# Altium project SOM Board with RK3399.PrjPcb (part 1 of 3)
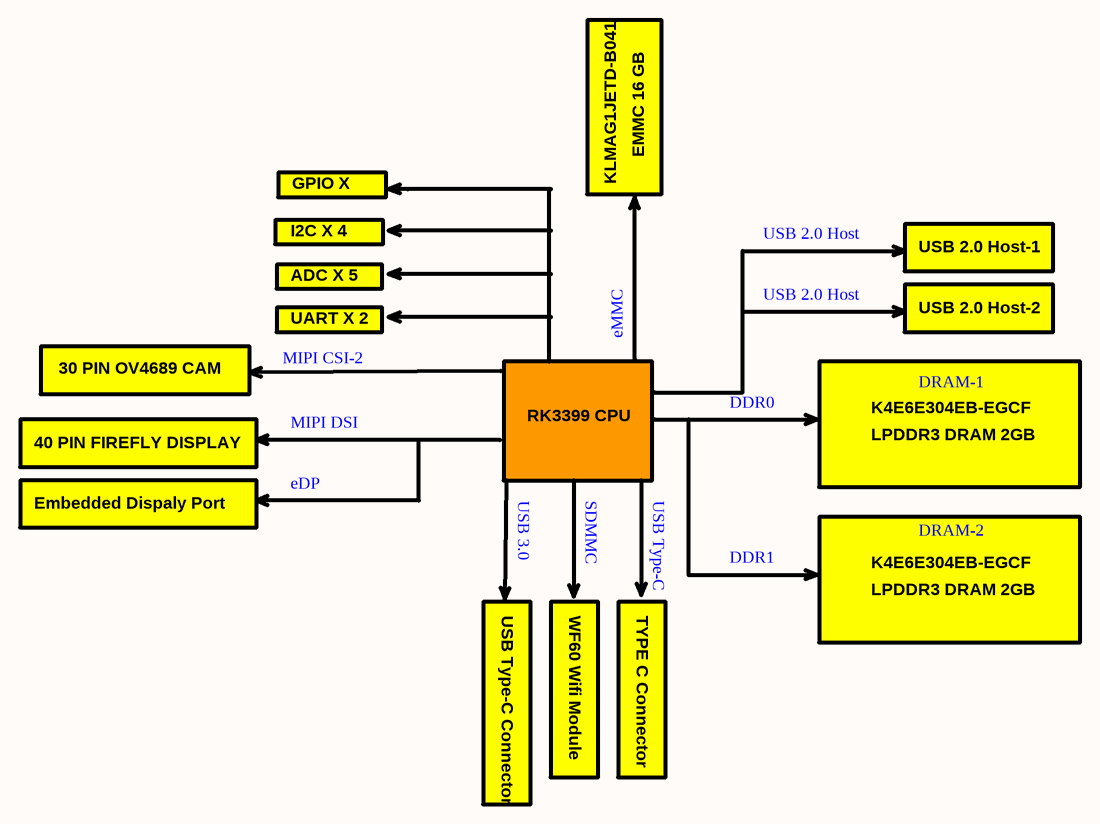
[diagram p0: [0]- Block Diagram.SchDoc]
12 sheets, 330 parts. Net scope: global (net labels, ports and power ports of the same name join across sheets).
Sheets:
  [0]- Block Diagram.SchDoc
  [1]-Power Pins Page of RK3399.SchDoc
  [2]-RK3399_EMMC_ADC_PCIE.SchDoc
  [3]-RK3399 EDP_CSI_HDMI.SchDoc
  [4]-USB2, TYPEC, USIC.SchDoc
  [5]-MIPI-CSI_GPIOs and I2C.SchDoc
  [6]-RGMII_SDIO_SPI_GPIOs etc.SchDoc
  [7]-RK3399 SDRAM Page.SchDoc
  [8]-LPDDR4 SDRAM-1.SchDoc
  [9]-LPDDR4 SDRAM-2.SchDoc
  [10]-EMMC Chip.SchDoc
  [11]-WIFI Module WF60.SchDoc

## Sheet [0]- Block Diagram.SchDoc: RK3399 SOM Board Design V1.0
size A4; Author: AVIRAL MISHRA; DocumentNumber: 1; SheetNumber: 1; SheetTotal: 12; PROJECT CODE: A_V1.0

### Notes on the sheet
- GPIO X
- KLMAG1JETD-B041
- EMMC 16 GB
- I2C X 4
- USB 2.0 Host
- USB 2.0 Host-1
- ADC X 5
- UART X 2
- eMMC
- USB 2.0 Host-2
- 30 PIN OV4689 CAM
- MIPI CSI-2
- DRAM-1
- 40 PIN FIREFLY DISPLAY
- MIPI DSI
- RK3399 CPU
- DDR0
- K4E6E304EB-EGCF
- LPDDR3 DRAM 2GB
- Embedded Dispaly Port
- eDP
- USB 3.0
- SDMMC
- USB Type-C
- DRAM-2
- DDR1
- USB Type-C Connector
- WF60 Wifi Module
- TYPE C Connector
- TITLE:
- DOCUMENT NAME:
- SCALE 1:1
- This document is copyright of EsteemPCB and shall not be revealed, produced, copied, in whole or in part, nor
- PROJECT CODE:
- TEMPLATE:
- A4
- AUTHOR:
- Sheet
- of
- used for any purpose other than submitted.

## Sheet [1]-Power Pins Page of RK3399.SchDoc: RK3399 SOM Board Design V1.0
size A3; Author: ABC; Organization: Altium Limited; Address1: L3, 12a Rodborough Rd; Address2: Frenchs Forest; Address3: NSW; Address4: Australia 2086; DocumentNumber: 2; SheetNumber: 2; SheetTotal: 12; PROJECT CODE: A_V1.0
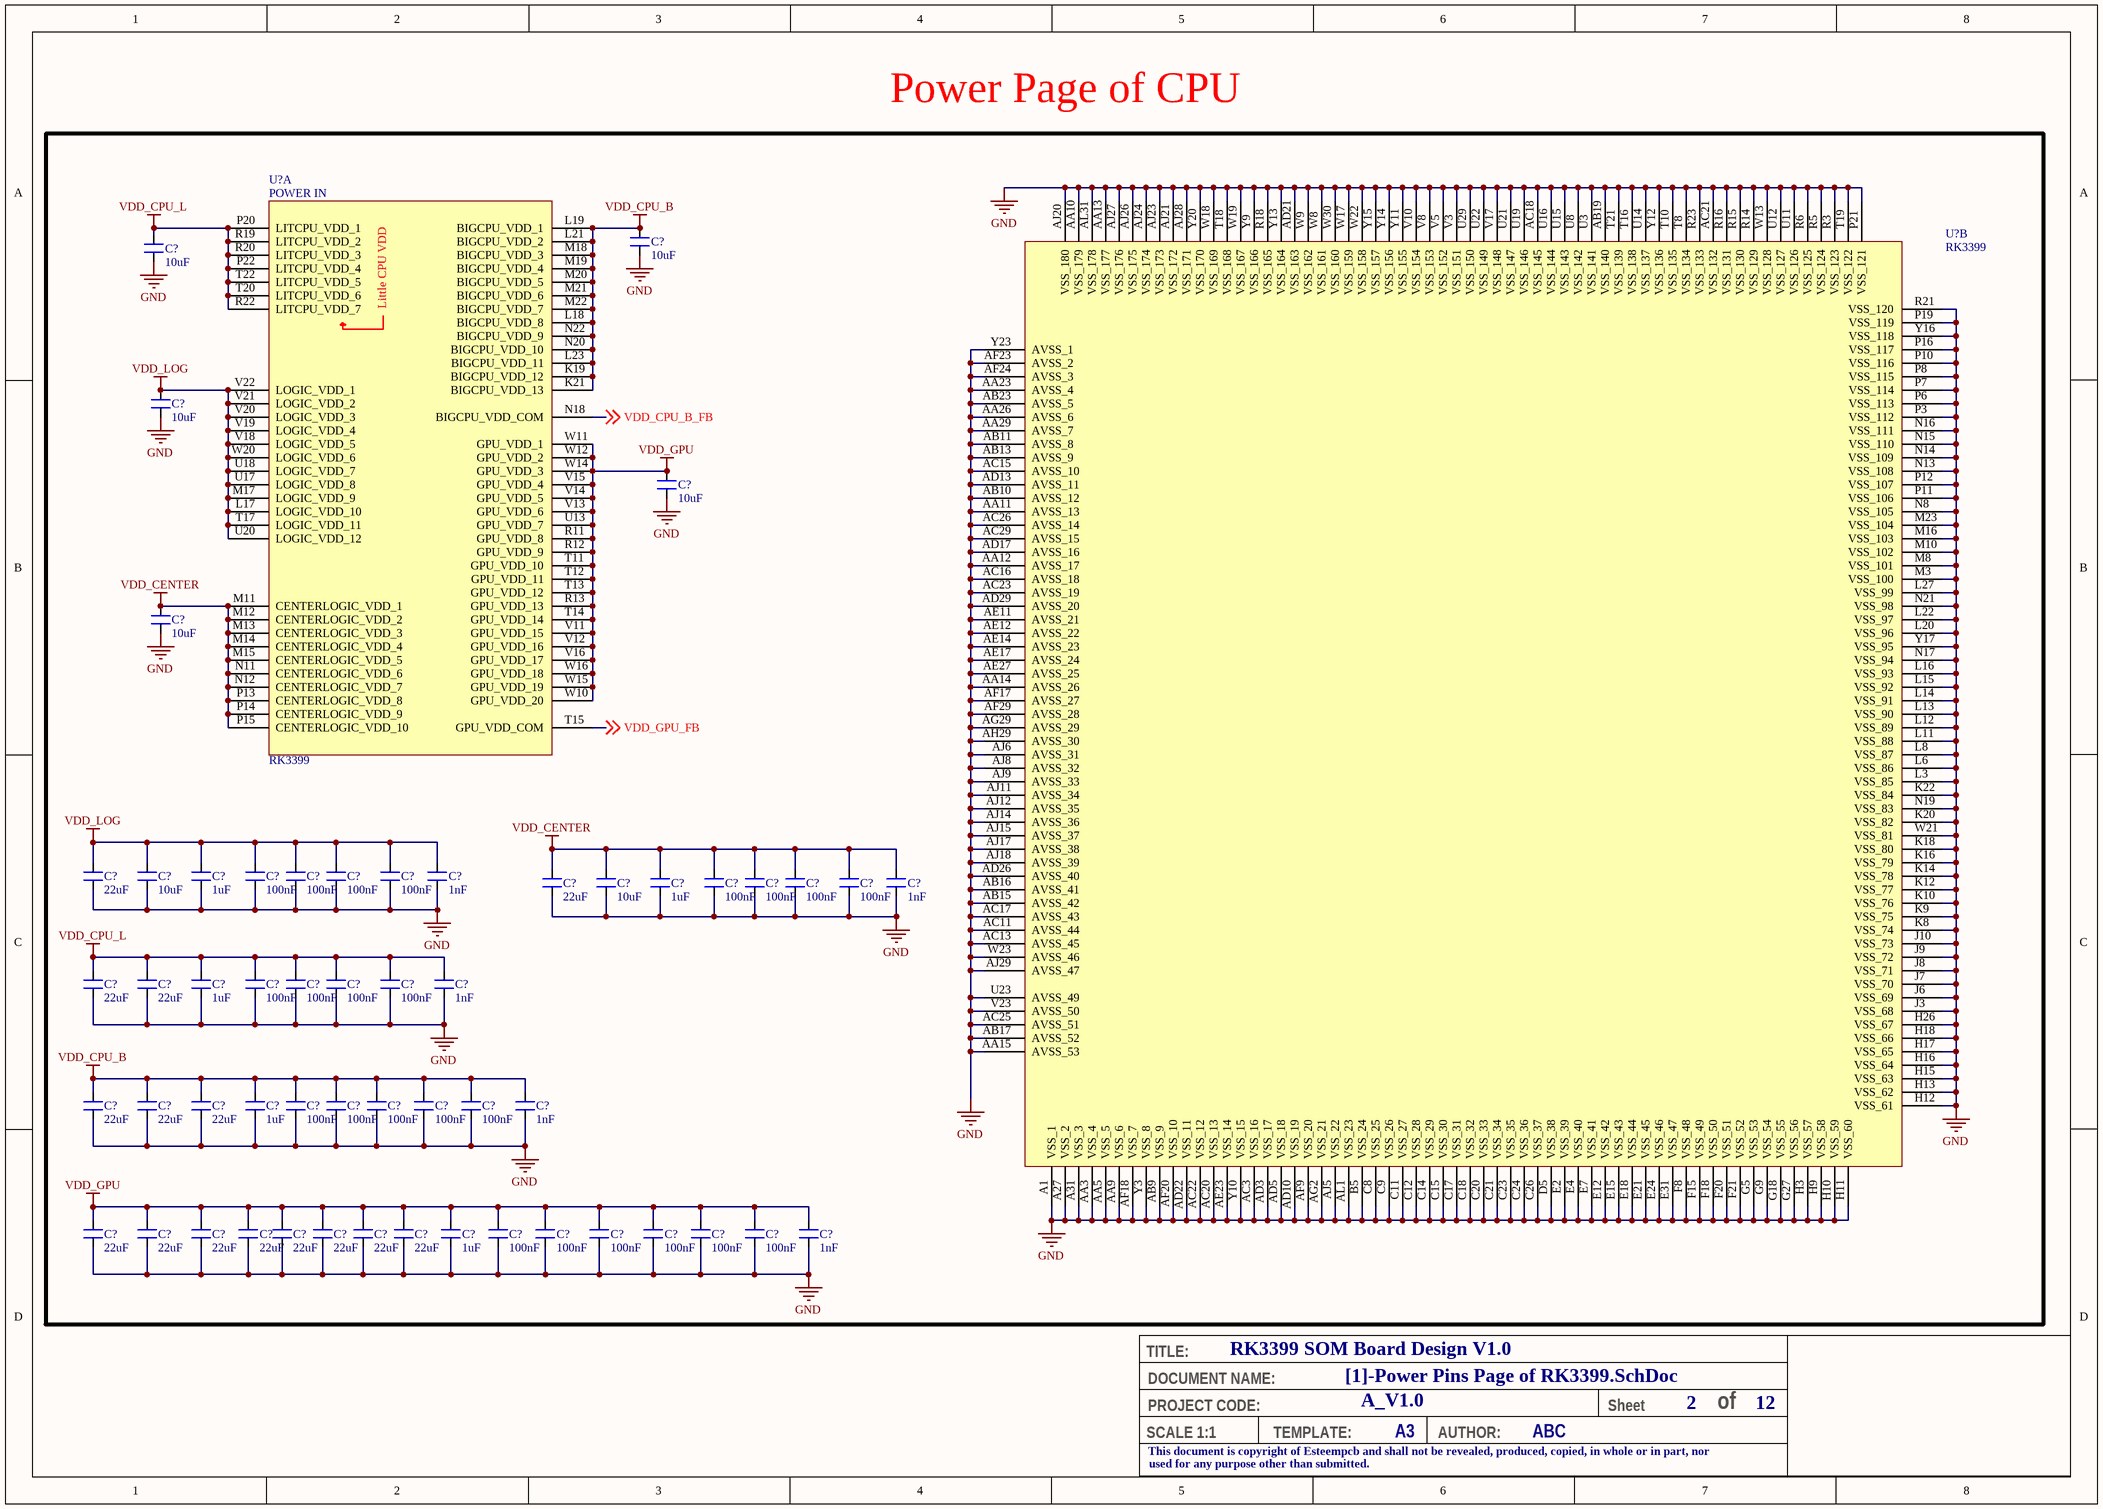
[diagram p1: [1]-Power Pins Page of RK3399.SchDoc]

### Parts
(Parts that share a designator on the sheet are numbered #1, #2 ... from top to bottom, then left to right.)
C?#1  10uF  [CAP_0402]
C?#2  10uF  [CAP_0402]
C?#3  10uF  [CAP_0402]
C?#4  10uF  [CAP_0402]
C?#5  10uF  [CAP_0402]
C?#6  22uF  [CAP_0402]
C?#7  10uF  [CAP_0402]
C?#8  1uF  [CAP_0201]
C?#9  100nF  [CAP_0201]
C?#10  100nF  [CAP_0201]
C?#11  100nF  [CAP_0201]
C?#12  100nF  [CAP_0201]
C?#13  1nF  [CAP_0201]
C?#14  22uF  [CAP_0402]
C?#15  10uF  [CAP_0402]
C?#16  1uF  [CAP_0201]
C?#17  100nF  [CAP_0201]
C?#18  100nF  [CAP_0201]
C?#19  100nF  [CAP_0201]
C?#20  100nF  [CAP_0201]
C?#21  1nF  [CAP_0201]
C?#22  22uF  [CAP_0402]
C?#23  22uF  [CAP_0402]
C?#24  1uF  [CAP_0201]
C?#25  100nF  [CAP_0201]
C?#26  100nF  [CAP_0201]
C?#27  100nF  [CAP_0201]
C?#28  100nF  [CAP_0201]
C?#29  1nF  [CAP_0201]
C?#30  22uF  [CAP_0402]
C?#31  22uF  [CAP_0402]
C?#32  22uF  [CAP_0402]
C?#33  1uF  [CAP_0201]
C?#34  100nF  [CAP_0201]
C?#35  100nF  [CAP_0201]
C?#36  100nF  [CAP_0201]
C?#37  100nF  [CAP_0201]
C?#38  100nF  [CAP_0201]
C?#39  1nF  [CAP_0201]
C?#40  22uF  [CAP_0402]
C?#41  22uF  [CAP_0402]
C?#42  22uF  [CAP_0402]
C?#43  22uF  [CAP_0402]
C?#44  22uF  [CAP_0402]
C?#45  22uF  [CAP_0402]
C?#46  22uF  [CAP_0402]
C?#47  22uF  [CAP_0402]
C?#48  1uF  [CAP_0201]
C?#49  100nF  [CAP_0201]
C?#50  100nF  [CAP_0201]
C?#51  100nF  [CAP_0201]
C?#52  100nF  [CAP_0201]
C?#53  100nF  [CAP_0201]
C?#54  100nF  [CAP_0201]
C?#55  1nF  [CAP_0201]
U?#1  RK3399  [FBGA828_23_826X826]  (part A of 24)
U?#2  RK3399  [FBGA828_23_826X826]  (part B of 24)

### Nets
GND: C?#1.1 C?#2.1 C?#3.1 C?#4.1 C?#5.1 C?#6.1 C?#7.1 C?#8.1 C?#9.1 C?#10.1 C?#11.1 C?#12.1 C?#13.1 C?#14.1 C?#15.1 C?#16.1 C?#17.1 C?#18.1 C?#19.1 C?#20.1 C?#21.1 C?#22.1 C?#23.1 C?#24.1 C?#25.1 C?#26.1 C?#27.1 C?#28.1 C?#29.1 C?#30.1 C?#31.1 C?#32.1 C?#33.1 C?#34.1 C?#35.1 C?#36.1 C?#37.1 C?#38.1 C?#39.1 C?#40.1 C?#41.1 C?#42.1 C?#43.1 C?#44.1 C?#45.1 C?#46.1 C?#47.1 C?#48.1 C?#49.1 C?#50.1 C?#51.1 C?#52.1 C?#53.1 C?#54.1 C?#55.1 U?#2.A1(VSS_1) U?#2.A27(VSS_2) U?#2.A31(VSS_3) U?#2.AA3(VSS_4) U?#2.AA5(VSS_5) U?#2.AA9(VSS_6) U?#2.AA10(VSS_179) U?#2.AA11(AVSS_13) U?#2.AA12(AVSS_17) U?#2.AA13(VSS_177) U?#2.AA14(AVSS_26) U?#2.AA15(AVSS_53) U?#2.AA23(AVSS_4) U?#2.AA26(AVSS_6) U?#2.AA29(AVSS_7) U?#2.AB9(VSS_9) U?#2.AB10(AVSS_12) U?#2.AB11(AVSS_8) U?#2.AB13(AVSS_9) U?#2.AB15(AVSS_42) U?#2.AB16(AVSS_41) U?#2.AB17(AVSS_52) U?#2.AB19(VSS_140) U?#2.AB23(AVSS_5) U?#2.AC3(VSS_16) U?#2.AC11(AVSS_44) U?#2.AC13(AVSS_45) U?#2.AC15(AVSS_10) U?#2.AC16(AVSS_18) U?#2.AC17(AVSS_43) U?#2.AC18(VSS_145) U?#2.AC20(VSS_13) U?#2.AC21(VSS_132) U?#2.AC22(VSS_12) U?#2.AC23(AVSS_19) U?#2.AC25(AVSS_51) U?#2.AC26(AVSS_14) U?#2.AC29(AVSS_15) U?#2.AD3(VSS_17) U?#2.AD5(VSS_18) U?#2.AD10(VSS_19) U?#2.AD13(AVSS_11) U?#2.AD17(AVSS_16) U?#2.AD21(VSS_163) U?#2.AD22(VSS_11) U?#2.AD26(AVSS_40) U?#2.AD29(AVSS_20) U?#2.AE11(AVSS_21) U?#2.AE12(AVSS_22) U?#2.AE14(AVSS_23) U?#2.AE17(AVSS_24) U?#2.AE23(VSS_14) U?#2.AE27(AVSS_25) U?#2.AF9(VSS_20) U?#2.AF17(AVSS_27) U?#2.AF18(VSS_7) U?#2.AF20(VSS_10) U?#2.AF23(AVSS_2) U?#2.AF24(AVSS_3) U?#2.AF29(AVSS_28) U?#2.AG2(VSS_21) U?#2.AG29(AVSS_29) U?#2.AH29(AVSS_30) U?#2.AJ5(VSS_22) U?#2.AJ6(AVSS_31) U?#2.AJ8(AVSS_32) U?#2.AJ9(AVSS_33) U?#2.AJ11(AVSS_34) U?#2.AJ12(AVSS_35) U?#2.AJ14(AVSS_36) U?#2.AJ15(AVSS_37) U?#2.AJ17(AVSS_38) U?#2.AJ18(AVSS_39) U?#2.AJ20(VSS_180) U?#2.AJ21(VSS_172) U?#2.AJ23(VSS_173) U?#2.AJ24(VSS_174) U?#2.AJ26(VSS_175) U?#2.AJ27(VSS_176) U?#2.AJ28(VSS_171) U?#2.AJ29(AVSS_47) U?#2.AL1(VSS_23) U?#2.AL31(VSS_178) U?#2.B5(VSS_24) U?#2.C8(VSS_25) U?#2.C9(VSS_26) U?#2.C11(VSS_27) U?#2.C12(VSS_28) U?#2.C14(VSS_29) U?#2.C15(VSS_30) U?#2.C17(VSS_31) U?#2.C18(VSS_32) U?#2.C20(VSS_33) U?#2.C21(VSS_34) U?#2.C23(VSS_35) U?#2.C24(VSS_36) U?#2.C26(VSS_37) U?#2.D5(VSS_38) U?#2.E2(VSS_39) U?#2.E4(VSS_40) U?#2.E7(VSS_41) U?#2.E12(VSS_42) U?#2.E15(VSS_43) U?#2.E18(VSS_44) U?#2.E21(VSS_45) U?#2.E24(VSS_46) U?#2.E31(VSS_47) U?#2.F8(VSS_48) U?#2.F15(VSS_49) U?#2.F18(VSS_50) U?#2.F20(VSS_51) U?#2.F21(VSS_52) U?#2.G5(VSS_53) U?#2.G9(VSS_54) U?#2.G18(VSS_55) U?#2.G27(VSS_56) U?#2.H3(VSS_57) U?#2.H9(VSS_58) U?#2.H10(VSS_59) U?#2.H11(VSS_60) U?#2.H12(VSS_61) U?#2.H13(VSS_62) U?#2.H15(VSS_63) U?#2.H16(VSS_64) U?#2.H17(VSS_65) U?#2.H18(VSS_66) U?#2.H26(VSS_67) U?#2.J3(VSS_68) U?#2.J6(VSS_69) U?#2.J7(VSS_70) U?#2.J8(VSS_71) U?#2.J9(VSS_72) U?#2.J10(VSS_73) U?#2.K8(VSS_74) U?#2.K9(VSS_75) U?#2.K10(VSS_76) U?#2.K12(VSS_77) U?#2.K14(VSS_78) U?#2.K16(VSS_79) U?#2.K18(VSS_80) U?#2.K20(VSS_82) U?#2.K22(VSS_84) U?#2.L3(VSS_85) U?#2.L6(VSS_86) U?#2.L8(VSS_87) U?#2.L11(VSS_88) U?#2.L12(VSS_89) U?#2.L13(VSS_90) U?#2.L14(VSS_91) U?#2.L15(VSS_92) U?#2.L16(VSS_93) U?#2.L20(VSS_96) U?#2.L22(VSS_97) U?#2.L27(VSS_99) U?#2.M3(VSS_100) U?#2.M8(VSS_101) U?#2.M10(VSS_102) U?#2.M16(VSS_103) U?#2.M23(VSS_104) U?#2.N8(VSS_105) U?#2.N13(VSS_108) U?#2.N14(VSS_109) U?#2.N15(VSS_110) U?#2.N16(VSS_111) U?#2.N17(VSS_94) U?#2.N19(VSS_83) U?#2.N21(VSS_98) U?#2.P3(VSS_112) U?#2.P6(VSS_113) U?#2.P7(VSS_114) U?#2.P8(VSS_115) U?#2.P10(VSS_116) U?#2.P11(VSS_106) U?#2.P12(VSS_107) U?#2.P16(VSS_117) U?#2.P19(VSS_119) U?#2.P21(VSS_121) U?#2.R3(VSS_123) U?#2.R5(VSS_124) U?#2.R6(VSS_125) U?#2.R14(VSS_129) U?#2.R15(VSS_130) U?#2.R16(VSS_131) U?#2.R18(VSS_165) U?#2.R21(VSS_120) U?#2.R23(VSS_133) U?#2.T8(VSS_134) U?#2.T10(VSS_135) U?#2.T16(VSS_138) U?#2.T18(VSS_168) U?#2.T19(VSS_122) U?#2.T21(VSS_139) U?#2.U3(VSS_141) U?#2.U8(VSS_142) U?#2.U11(VSS_126) U?#2.U12(VSS_127) U?#2.U14(VSS_137) U?#2.U15(VSS_143) U?#2.U16(VSS_144) U?#2.U19(VSS_146) U?#2.U21(VSS_147) U?#2.U22(VSS_149) U?#2.U23(AVSS_49) U?#2.U29(VSS_150) U?#2.V3(VSS_151) U?#2.V5(VSS_152) U?#2.V8(VSS_153) U?#2.V10(VSS_154) U?#2.V17(VSS_148) U?#2.V23(AVSS_50) U?#2.W8(VSS_161) U?#2.W9(VSS_162) U?#2.W13(VSS_128) U?#2.W17(VSS_159) U?#2.W18(VSS_169) U?#2.W19(VSS_167) U?#2.W21(VSS_81) U?#2.W22(VSS_158) U?#2.W23(AVSS_46) U?#2.W30(VSS_160) U?#2.Y3(VSS_8) U?#2.Y9(VSS_166) U?#2.Y10(VSS_15) U?#2.Y11(VSS_155) U?#2.Y12(VSS_136) U?#2.Y13(VSS_164) U?#2.Y14(VSS_156) U?#2.Y15(VSS_157) U?#2.Y16(VSS_118) U?#2.Y17(VSS_95) U?#2.Y20(VSS_170) U?#2.Y23(AVSS_1)
VDD_CENTER: C?#5.2 C?#14.2 C?#15.2 C?#16.2 C?#17.2 C?#18.2 C?#19.2 C?#20.2 C?#21.2 U?#1.M11(CENTERLOGIC_VDD_1) U?#1.M12(CENTERLOGIC_VDD_2) U?#1.M13(CENTERLOGIC_VDD_3) U?#1.M14(CENTERLOGIC_VDD_4) U?#1.M15(CENTERLOGIC_VDD_5) U?#1.N11(CENTERLOGIC_VDD_6) U?#1.N12(CENTERLOGIC_VDD_7) U?#1.P13(CENTERLOGIC_VDD_8) U?#1.P14(CENTERLOGIC_VDD_9) U?#1.P15(CENTERLOGIC_VDD_10)
VDD_CPU_B: C?#1.2 C?#30.2 C?#31.2 C?#32.2 C?#33.2 C?#34.2 C?#35.2 C?#36.2 C?#37.2 C?#38.2 C?#39.2 U?#1.K19(BIGCPU_VDD_12) U?#1.K21(BIGCPU_VDD_13) U?#1.L18(BIGCPU_VDD_8) U?#1.L19(BIGCPU_VDD_1) U?#1.L21(BIGCPU_VDD_2) U?#1.L23(BIGCPU_VDD_11) U?#1.M18(BIGCPU_VDD_3) U?#1.M19(BIGCPU_VDD_4) U?#1.M20(BIGCPU_VDD_5) U?#1.M21(BIGCPU_VDD_6) U?#1.M22(BIGCPU_VDD_7) U?#1.N20(BIGCPU_VDD_10) U?#1.N22(BIGCPU_VDD_9)
VDD_CPU_L: C?#2.2 C?#22.2 C?#23.2 C?#24.2 C?#25.2 C?#26.2 C?#27.2 C?#28.2 C?#29.2 U?#1.P20(LITCPU_VDD_1) U?#1.P22(LITCPU_VDD_4) U?#1.R19(LITCPU_VDD_2) U?#1.R20(LITCPU_VDD_3) U?#1.R22(LITCPU_VDD_7) U?#1.T20(LITCPU_VDD_6) U?#1.T22(LITCPU_VDD_5)
VDD_GPU: C?#4.2 C?#40.2 C?#41.2 C?#42.2 C?#43.2 C?#44.2 C?#45.2 C?#46.2 C?#47.2 C?#48.2 C?#49.2 C?#50.2 C?#51.2 C?#52.2 C?#53.2 C?#54.2 C?#55.2 U?#1.R11(GPU_VDD_8) U?#1.R12(GPU_VDD_9) U?#1.R13(GPU_VDD_13) U?#1.T11(GPU_VDD_10) U?#1.T12(GPU_VDD_11) U?#1.T13(GPU_VDD_12) U?#1.T14(GPU_VDD_14) U?#1.U13(GPU_VDD_7) U?#1.V11(GPU_VDD_15) U?#1.V12(GPU_VDD_16) U?#1.V13(GPU_VDD_6) U?#1.V14(GPU_VDD_5) U?#1.V15(GPU_VDD_4) U?#1.V16(GPU_VDD_17) U?#1.W10(GPU_VDD_20) U?#1.W11(GPU_VDD_1) U?#1.W12(GPU_VDD_2) U?#1.W14(GPU_VDD_3) U?#1.W15(GPU_VDD_19) U?#1.W16(GPU_VDD_18)
VDD_LOG: C?#3.2 C?#6.2 C?#7.2 C?#8.2 C?#9.2 C?#10.2 C?#11.2 C?#12.2 C?#13.2 U?#1.L17(LOGIC_VDD_10) U?#1.M17(LOGIC_VDD_9) U?#1.T17(LOGIC_VDD_11) U?#1.U17(LOGIC_VDD_8) U?#1.U18(LOGIC_VDD_7) U?#1.U20(LOGIC_VDD_12) U?#1.V18(LOGIC_VDD_5) U?#1.V19(LOGIC_VDD_4) U?#1.V20(LOGIC_VDD_3) U?#1.V21(LOGIC_VDD_2) U?#1.V22(LOGIC_VDD_1) U?#1.W20(LOGIC_VDD_6)
VDD_CPU_B_FB: U?#1.N18(BIGCPU_VDD_COM) ; off-sheet VDD_CPU_B_FB
VDD_GPU_FB: U?#1.T15(GPU_VDD_COM) ; off-sheet VDD_GPU_FB

### Notes on the sheet
- Power Page of CPU
- TITLE:
- DOCUMENT NAME:
- SCALE 1:1
- This document is copyright of Esteempcb and shall not be revealed, produced, copied, in whole or in part, nor
- PROJECT CODE:
- TEMPLATE:
- A3
- AUTHOR:
- Sheet
- of
- used for any purpose other than submitted.
- (in symbol IC_RK3399-FCBGA828, part A) POWER IN; Little CPU VDD

### Library data of the parts
C?#1-C?#5 C?#7 C?#15 = CAP_10uF-10V-20%-0402: 10µF ±20% 10V Ceramic Capacitor X5R 0402 (1005 Metric) /; Manufacturer Part Number: CL05A106MP5NUNC; Manufacturer: Samsung Electro-Mechanics; Case/Package: 0402; Supplier-1: Digikey
C?#6 C?#14 C?#22 C?#23 C?#30-C?#32 C?#40-C?#47 = CAP_22uF-6.3V-20%-0402: 22µF ±20% 6.3V Ceramic Capacitor X5R 0402 (1005 Metric) /; Manufacturer: Murata Electronics; Manufacturer Part Number: CL05A226MQ5N6J8; Case/Package: 0402; Supplier-1: Digikey
C?#8 C?#16 C?#24 C?#33 C?#48 = CAP_1uF-16V-10%-0201: 1µF ±20% 16V Ceramic Capacitor X5R 0201 (0603 Metric) /; Manufacturer: Samsung Electro-Mechanics; Manufacturer Part Number: CL03A105MO3NRNH; Case/Package: 0201; Supplier-1: Digikey
C?#9-C?#12 C?#17-C?#20 C?#25-C?#28 C?#34-C?#38 C?#49-C?#54 = CAP_100nF-25V-10%-0201: 0.1µF ±10% 25V Ceramic Capacitor X5R 0201 (0603 Metric) /; Manufacturer: TDK Corporation; Manufacturer Part Number: C0603X5R1E104K030BB; Case/Package: 0201; Supplier-1: Digikey
C?#13 C?#21 C?#29 C?#39 C?#55 = CAP_1nF-16V-10%-0201: 1000pF ±10% 16V Ceramic Capacitor X7R 0201 (0603 Metric) /; Manufacturer: Murata Electronics; Manufacturer Part Number: GRM033R71C102KA01D; Case/Package: 0201; Supplier-1: Digikey
U?#1 U?#2 = IC_RK3399-FCBGA828: RK3399 is a low power, high performance processor for computing, personal mobile.; Manufacturer: Rockchip; Manufacturer Part Number: RK3399; Case/Package: FCBGA828; Supplier-1: Rockchip

## Sheet [2]-RK3399_EMMC_ADC_PCIE.SchDoc: RK3399 SOM Board Design V1.0
size A4; Author: AVIRAL MISHRA; DocumentNumber: 3; SheetNumber: 3; SheetTotal: 12; PROJECT CODE: A_V1.0
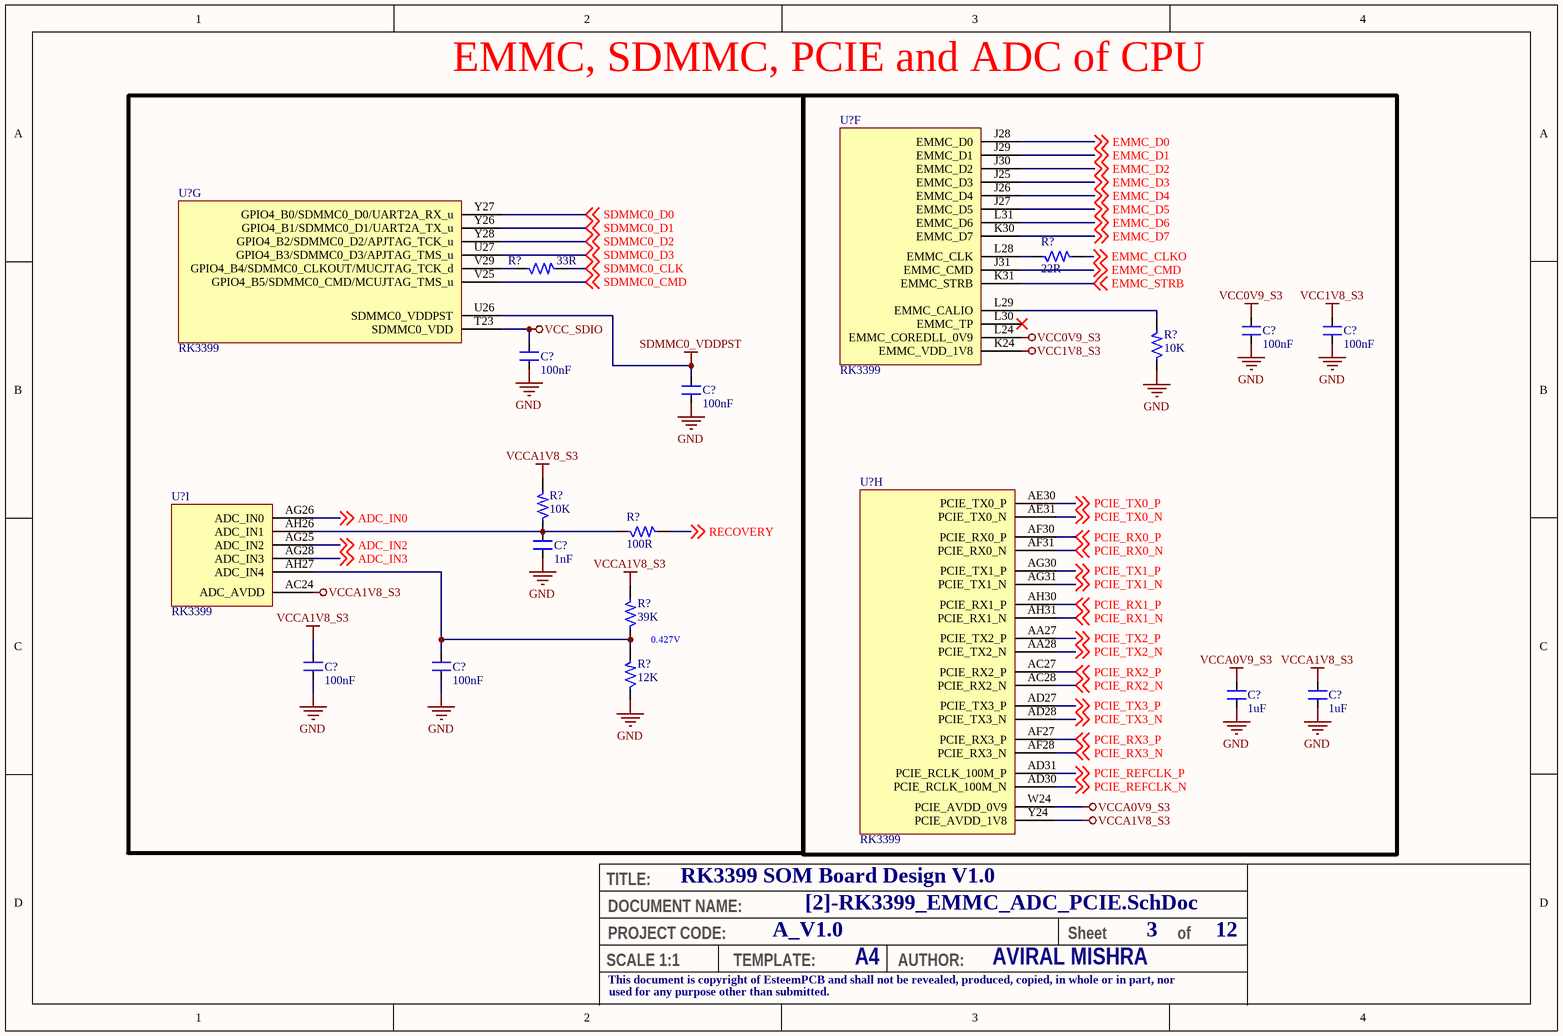
[diagram p2: [2]-RK3399_EMMC_ADC_PCIE.SchDoc]

### Parts
(Parts that share a designator on the sheet are numbered #1, #2 ... from top to bottom, then left to right.)
C?#56  100nF  [CAP_0201]
C?#57  100nF  [CAP_0201]
C?#58  100nF  [CAP_0201]
C?#59  100nF  [CAP_0201]
C?#60  1nF  [CAP_0201]
C?#61  100nF  [CAP_0201]
C?#62  100nF  [CAP_0201]
C?#63  1uF  [CAP_0201]
C?#64  1uF  [CAP_0201]
R?#1  22R  [RES_0201]
R?#2  33R  [RES_0201]
R?#3  10K  [RES_0201]
R?#4  10K  [RES_0201]
R?#5  100R  [RES_0201]
R?#6  39K  [RES_0201]
R?#7  12K  [RES_0201]
U?#3  RK3399  [FBGA828_23_826X826]  (part F of 24)
U?#4  RK3399  [FBGA828_23_826X826]  (part G of 24)
U?#5  RK3399  [FBGA828_23_826X826]  (part H of 24)
U?#6  RK3399  [FBGA828_23_826X826]  (part I of 24)

### Blocks framed on the sheet
EMMC, SDMMC, PCIE and ADC of CPU: C?#58-C?#62 R?#2 R?#4-R?#7 U?#4 U?#6

### Nets
GND: C?#56.1 C?#57.1 C?#58.1 C?#59.1 C?#60.1 C?#61.1 C?#62.1 C?#63.1 C?#64.1 R?#3.1 R?#7.1
SDMMC0_VDDPST: C?#59.2 U?#4.U26(SDMMC0_VDDPST)
VCC0V9_S3: C?#56.2 U?#3.L24(EMMC_COREDLL_0V9)
VCC1V8_S3: C?#57.2 U?#3.K24(EMMC_VDD_1V8)
VCC_SDIO: C?#58.2 U?#4.T23(SDMMC0_VDD)
VCCA0V9_S3: C?#63.2 U?#5.W24(PCIE_AVDD_0V9)
VCCA1V8_S3: C?#61.2 C?#64.2 R?#4.2 R?#6.2 U?#5.Y24(PCIE_AVDD_1V8) U?#6.AC24(ADC_AVDD)
ADC_IN0: U?#6.AG26(ADC_IN0) ; off-sheet ADC_IN0
ADC_IN2: U?#6.AG25(ADC_IN2) ; off-sheet ADC_IN2
ADC_IN3: U?#6.AG28(ADC_IN3) ; off-sheet ADC_IN3
EMMC_CLKO: R?#1.2 ; off-sheet EMMC_CLKO
EMMC_CMD: U?#3.J31(EMMC_CMD) ; off-sheet EMMC_CMD
EMMC_D0: U?#3.J28(EMMC_D0) ; off-sheet EMMC_D0
EMMC_D1: U?#3.J29(EMMC_D1) ; off-sheet EMMC_D1
EMMC_D2: U?#3.J30(EMMC_D2) ; off-sheet EMMC_D2
EMMC_D3: U?#3.J25(EMMC_D3) ; off-sheet EMMC_D3
EMMC_D4: U?#3.J26(EMMC_D4) ; off-sheet EMMC_D4
EMMC_D5: U?#3.J27(EMMC_D5) ; off-sheet EMMC_D5
EMMC_D6: U?#3.L31(EMMC_D6) ; off-sheet EMMC_D6
EMMC_D7: U?#3.K30(EMMC_D7) ; off-sheet EMMC_D7
EMMC_STRB: U?#3.K31(EMMC_STRB) ; off-sheet EMMC_STRB
PCIE_REFCLK_N: U?#5.AD30(PCIE_RCLK_100M_N) ; off-sheet PCIE_REFCLK_N
PCIE_REFCLK_P: U?#5.AD31(PCIE_RCLK_100M_P) ; off-sheet PCIE_REFCLK_P
PCIE_RX0_N: U?#5.AF31(PCIE_RX0_N) ; off-sheet PCIE_RX0_N
PCIE_RX0_P: U?#5.AF30(PCIE_RX0_P) ; off-sheet PCIE_RX0_P
PCIE_RX1_N: U?#5.AH31(PCIE_RX1_N) ; off-sheet PCIE_RX1_N
PCIE_RX1_P: U?#5.AH30(PCIE_RX1_P) ; off-sheet PCIE_RX1_P
PCIE_RX2_N: U?#5.AC28(PCIE_RX2_N) ; off-sheet PCIE_RX2_N
PCIE_RX2_P: U?#5.AC27(PCIE_RX2_P) ; off-sheet PCIE_RX2_P
PCIE_RX3_N: U?#5.AF28(PCIE_RX3_N) ; off-sheet PCIE_RX3_N
PCIE_RX3_P: U?#5.AF27(PCIE_RX3_P) ; off-sheet PCIE_RX3_P
PCIE_TX0_N: U?#5.AE31(PCIE_TX0_N) ; off-sheet PCIE_TX0_N
PCIE_TX0_P: U?#5.AE30(PCIE_TX0_P) ; off-sheet PCIE_TX0_P
PCIE_TX1_N: U?#5.AG31(PCIE_TX1_N) ; off-sheet PCIE_TX1_N
PCIE_TX1_P: U?#5.AG30(PCIE_TX1_P) ; off-sheet PCIE_TX1_P
PCIE_TX2_N: U?#5.AA28(PCIE_TX2_N) ; off-sheet PCIE_TX2_N
PCIE_TX2_P: U?#5.AA27(PCIE_TX2_P) ; off-sheet PCIE_TX2_P
PCIE_TX3_N: U?#5.AD28(PCIE_TX3_N) ; off-sheet PCIE_TX3_N
PCIE_TX3_P: U?#5.AD27(PCIE_TX3_P) ; off-sheet PCIE_TX3_P
RECOVERY: R?#5.2 ; off-sheet RECOVERY
SDMMC0_CLK: R?#2.2 ; off-sheet SDMMC0_CLK
SDMMC0_CMD: U?#4.V25(GPIO4_B5/SDMMC0_CMD/MCUJTAG_TMS_u) ; off-sheet SDMMC0_CMD
SDMMC0_D0: U?#4.Y27(GPIO4_B0/SDMMC0_D0/UART2A_RX_u) ; off-sheet SDMMC0_D0
SDMMC0_D1: U?#4.Y26(GPIO4_B1/SDMMC0_D1/UART2A_TX_u) ; off-sheet SDMMC0_D1
SDMMC0_D2: U?#4.Y28(GPIO4_B2/SDMMC0_D2/APJTAG_TCK_u) ; off-sheet SDMMC0_D2
SDMMC0_D3: U?#4.U27(GPIO4_B3/SDMMC0_D3/APJTAG_TMS_u) ; off-sheet SDMMC0_D3
NetC?#60_2: C?#60.2 R?#4.1 R?#5.1 U?#6.AH26(ADC_IN1)
NetC?#62_2: C?#62.2 R?#6.1 R?#7.2 U?#6.AH27(ADC_IN4)
NetR?#1_1: R?#1.1 U?#3.L28(EMMC_CLK)
NetR?#2_1: R?#2.1 U?#4.V29(GPIO4_B4/SDMMC0_CLKOUT/MUCJTAG_TCK_d)
NetR?#3_2: R?#3.2 U?#3.L29(EMMC_CALIO)

Not connected (* = marked no-connect by the designer): U?#3 L30(EMMC_TP)*

### Notes on the sheet
- (near R?#6) 0.427V
- TITLE:
- DOCUMENT NAME:
- SCALE 1:1
- This document is copyright of EsteemPCB and shall not be revealed, produced, copied, in whole or in part, nor
- PROJECT CODE:
- TEMPLATE:
- A4
- AUTHOR:
- Sheet
- of
- used for any purpose other than submitted.

### Library data of the parts
C?#56-C?#59 C?#61 C?#62 = CAP_100nF-25V-10%-0201: as C?#9 on sheet [1]-Power Pins Page of RK3399; Case/Package: 0201; Supplier-1: Digikey
C?#60 = CAP_1nF-16V-10%-0201: as C?#13 on sheet [1]-Power Pins Page of RK3399; Case/Package: 0201; Supplier-1: Digikey
C?#63 C?#64 = CAP_1uF-16V-10%-0201: as C?#8 on sheet [1]-Power Pins Page of RK3399; Case/Package: 0201; Supplier-1: Digikey
R?#1 = RES_22R-0.05W-1%-0201: 22 Ohms ±1% 0.05W, 1/20W Chip Resistor 0201 (0603 Metric) Moisture Resistant Thick Film /; Manufacturer: Yageo; Manufacturer Part Number: RC0201FR-0722RL; Case/Package: 0201; Supplier-1: Digikey
R?#2 = RES_33R-0.05W-1%-0201: 33 Ohms ±1% 0.05W, 1/20W Chip Resistor 0201 (0603 Metric) Thick Film /; Manufacturer: Yageo; Manufacturer Part Number: RC0201FR-0733RL; Case/Package: 0201; Supplier-1: Digikey
R?#3 R?#4 = RES_10K-0.05W-1%-0201: 10 kOhms ±1% 0.05W, 1/20W Chip Resistor 0201 (0603 Metric) Thick Film /; Manufacturer: Stackpole Electronics Inc; Manufacturer Part Number: RMCF0201FT10K0; Case/Package: 0201; Supplier-1: Digikey
R?#5 = RES_100R-0.05W-1%-0201: 100 kOhms ±1% 0.05W, 1/20W Chip Resistor 0201 (0603 Metric) Automotive AEC-Q200 Thick Film /; Manufacturer: Panasonic Electronic Components; Manufacturer Part Number: ERJ-1GNF1003C; Case/Package: 0201; Supplier-1: Digikey
R?#6 = RES_39K-0.05W-1%-0201: 39 kOhms ±1% 0.05W, 1/20W Chip Resistor 0201 (0603 Metric) Thick Film /; Manufacturer: Yageo; Manufacturer Part Number: RC0201FR-0739KL; Case/Package: 0201; Supplier-1: Digikey
R?#7 = RES_12K-0.05W-1%-0201: 12 kOhms ±1% 0.05W, 1/20W Chip Resistor 0201 (0603 Metric) Thick Film /; Manufacturer: Yageo; Manufacturer Part Number: RC0201FR-0712KL; Case/Package: 0201; Supplier-1: Digikey
U?#3-U?#6 = IC_RK3399-FCBGA828: as U?#1 on sheet [1]-Power Pins Page of RK3399; Manufacturer Part Number: RK3399; Case/Package: FCBGA828; Supplier-1: Rockchip

## Sheet [3]-RK3399 EDP_CSI_HDMI.SchDoc: RK3399 SOM Board Design V1.0
size A4; Author: AVIRAL MISHRA; DocumentNumber: 4; SheetNumber: 4; SheetTotal: 12; PROJECT CODE: A_V1.0
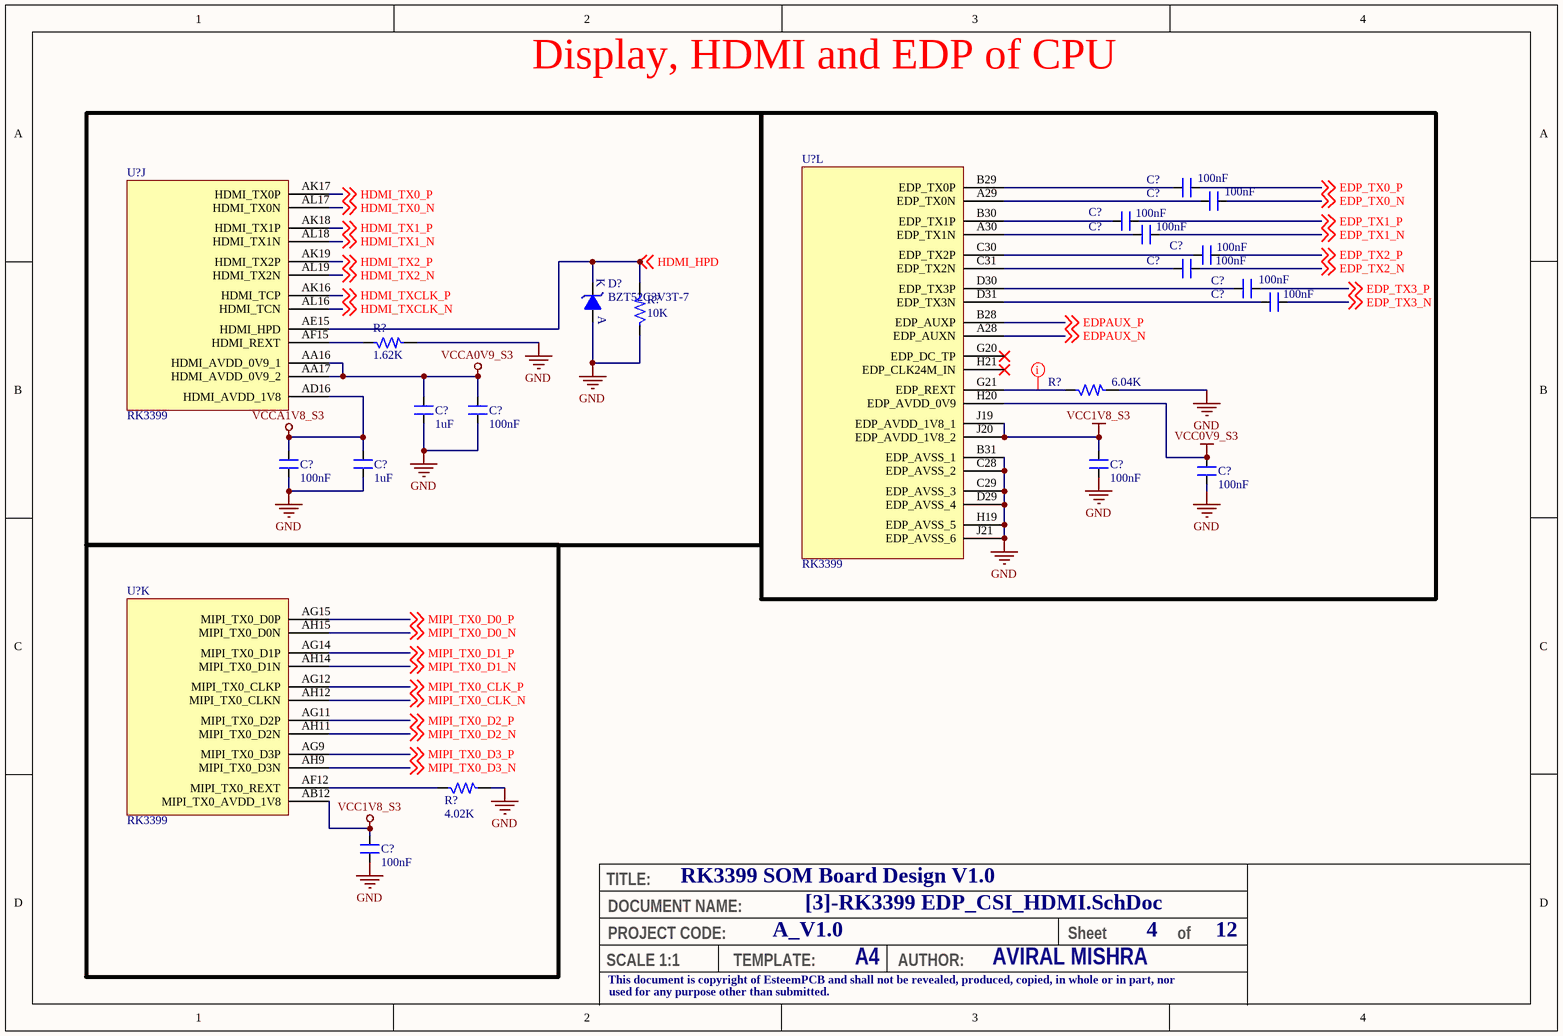
[diagram p3: [3]-RK3399 EDP_CSI_HDMI.SchDoc]

### Parts
(Parts that share a designator on the sheet are numbered #1, #2 ... from top to bottom, then left to right.)
C?#65  100nF  [CAP_0201]
C?#66  100nF  [CAP_0201]
C?#67  100nF  [CAP_0201]
C?#68  100nF  [CAP_0201]
C?#69  100nF  [CAP_0201]
C?#70  100nF  [CAP_0201]
C?#71  100nF  [CAP_0201]
C?#72  100nF  [CAP_0201]
C?#73  1uF  [CAP_0201]
C?#74  100nF  [CAP_0201]
C?#75  100nF  [CAP_0201]
C?#76  1uF  [CAP_0201]
C?#77  100nF  [CAP_0201]
C?#78  100nF  [CAP_0201]
C?#79  100nF  [CAP_0201]
D?#1  BZT52C3V3T-7  [DIO_SOD523]
R?#8  10K  [RES_0201]
R?#9  1.62K  [RES_0201]
R?#10  6.04K  [RES_0201]
R?#11  4.02K  [RES_0201]
U?#7  RK3399  [FBGA828_23_826X826]  (part L of 24)
U?#8  RK3399  [FBGA828_23_826X826]  (part J of 24)
U?#9  RK3399  [FBGA828_23_826X826]  (part K of 24)

### Nets
GND: C?#73.1 C?#74.1 C?#75.1 C?#76.1 C?#77.2 C?#78.1 C?#79.1 D?#1.A R?#8.1 R?#9.2 R?#10.2 R?#11.2 U?#7.B31(EDP_AVSS_1) U?#7.C28(EDP_AVSS_2) U?#7.C29(EDP_AVSS_3) U?#7.D29(EDP_AVSS_4) U?#7.H19(EDP_AVSS_5) U?#7.J21(EDP_AVSS_6)
VCC0V9_S3: C?#78.2 U?#7.H20(EDP_AVDD_0V9)
VCC1V8_S3: C?#77.1 C?#79.2 U?#7.J19(EDP_AVDD_1V8_1) U?#7.J20(EDP_AVDD_1V8_2) U?#9.AB12(MIPI_TX0_AVDD_1V8)
VCCA0V9_S3: C?#73.2 C?#74.2 U?#8.AA16(HDMI_AVDD_0V9_1) U?#8.AA17(HDMI_AVDD_0V9_2)
VCCA1V8_S3: C?#75.2 C?#76.2 U?#8.AD16(HDMI_AVDD_1V8)
EDP_TX0_N: C?#66.1 ; off-sheet EDP_TX0_N
EDP_TX0_P: C?#65.1 ; off-sheet EDP_TX0_P
EDP_TX1_N: C?#68.1 ; off-sheet EDP_TX1_N
EDP_TX1_P: C?#67.1 ; off-sheet EDP_TX1_P
EDP_TX2_N: C?#70.1 ; off-sheet EDP_TX2_N
EDP_TX2_P: C?#69.1 ; off-sheet EDP_TX2_P
EDP_TX3_N: C?#72.1 ; off-sheet EDP_TX3_N
EDP_TX3_P: C?#71.1 ; off-sheet EDP_TX3_P
EDPAUX_N: U?#7.A28(EDP_AUXN) ; off-sheet EDPAUX_N
EDPAUX_P: U?#7.B28(EDP_AUXP) ; off-sheet EDPAUX_P
HDMI_HPD: D?#1.K R?#8.2 U?#8.AE15(HDMI_HPD) ; off-sheet HDMI_HPD
HDMI_TX0_N: U?#8.AL17(HDMI_TX0N) ; off-sheet HDMI_TX0_N
HDMI_TX0_P: U?#8.AK17(HDMI_TX0P) ; off-sheet HDMI_TX0_P
HDMI_TX1_N: U?#8.AL18(HDMI_TX1N) ; off-sheet HDMI_TX1_N
HDMI_TX1_P: U?#8.AK18(HDMI_TX1P) ; off-sheet HDMI_TX1_P
HDMI_TX2_N: U?#8.AL19(HDMI_TX2N) ; off-sheet HDMI_TX2_N
HDMI_TX2_P: U?#8.AK19(HDMI_TX2P) ; off-sheet HDMI_TX2_P
HDMI_TXCLK_N: U?#8.AL16(HDMI_TCN) ; off-sheet HDMI_TXCLK_N
HDMI_TXCLK_P: U?#8.AK16(HDMI_TCP) ; off-sheet HDMI_TXCLK_P
MIPI_TX0_CLK_N: U?#9.AH12(MIPI_TX0_CLKN) ; off-sheet MIPI_TX0_CLK_N
MIPI_TX0_CLK_P: U?#9.AG12(MIPI_TX0_CLKP) ; off-sheet MIPI_TX0_CLK_P
MIPI_TX0_D0_N: U?#9.AH15(MIPI_TX0_D0N) ; off-sheet MIPI_TX0_D0_N
MIPI_TX0_D0_P: U?#9.AG15(MIPI_TX0_D0P) ; off-sheet MIPI_TX0_D0_P
MIPI_TX0_D1_N: U?#9.AH14(MIPI_TX0_D1N) ; off-sheet MIPI_TX0_D1_N
MIPI_TX0_D1_P: U?#9.AG14(MIPI_TX0_D1P) ; off-sheet MIPI_TX0_D1_P
MIPI_TX0_D2_N: U?#9.AH11(MIPI_TX0_D2N) ; off-sheet MIPI_TX0_D2_N
MIPI_TX0_D2_P: U?#9.AG11(MIPI_TX0_D2P) ; off-sheet MIPI_TX0_D2_P
MIPI_TX0_D3_N: U?#9.AH9(MIPI_TX0_D3N) ; off-sheet MIPI_TX0_D3_N
MIPI_TX0_D3_P: U?#9.AG9(MIPI_TX0_D3P) ; off-sheet MIPI_TX0_D3_P
NetC?#65_2: C?#65.2 U?#7.B29(EDP_TX0P)
NetC?#66_2: C?#66.2 U?#7.A29(EDP_TX0N)
NetC?#67_2: C?#67.2 U?#7.B30(EDP_TX1P)
NetC?#68_2: C?#68.2 U?#7.A30(EDP_TX1N)
NetC?#69_2: C?#69.2 U?#7.C30(EDP_TX2P)
NetC?#70_2: C?#70.2 U?#7.C31(EDP_TX2N)
NetC?#71_2: C?#71.2 U?#7.D30(EDP_TX3P)
NetC?#72_2: C?#72.2 U?#7.D31(EDP_TX3N)
NetR?#9_1: R?#9.1 U?#8.AF15(HDMI_REXT)
NetR?#10_1: R?#10.1 U?#7.G21(EDP_REXT)
NetR?#11_1: R?#11.1 U?#9.AF12(MIPI_TX0_REXT)

Not connected (* = marked no-connect by the designer): U?#7 G20(EDP_DC_TP)* H21(EDP_CLK24M_IN)*

### Layout directives
net class EDP_GROUP: NetR?#10_1

### Notes on the sheet
- Display, HDMI and EDP of CPU
- TITLE:
- DOCUMENT NAME:
- SCALE 1:1
- This document is copyright of EsteemPCB and shall not be revealed, produced, copied, in whole or in part, nor
- PROJECT CODE:
- TEMPLATE:
- A4
- AUTHOR:
- Sheet
- of
- used for any purpose other than submitted.

### Library data of the parts
C?#65-C?#72 C?#74 C?#75 C?#77-C?#79 = CAP_100nF-25V-10%-0201: as C?#9 on sheet [1]-Power Pins Page of RK3399; Case/Package: 0201; Supplier-1: Digikey
C?#73 C?#76 = CAP_1uF-16V-10%-0201: as C?#8 on sheet [1]-Power Pins Page of RK3399; Case/Package: 0201; Supplier-1: Digikey
D?#1 = DIO-Z_3.3V-300mW-SOD-523: Zener Diode 3.3V 300mW ±6% Surface Mount SOD-523 /; Manufacturer: Diodes Incorporated; Manufacturer Part Number: BZT52C3V3T-7; Case/Package: SOD523; Supplier-1: Digikey
R?#8 = RES_10K-0.05W-1%-0201: as R?#3 on sheet [2]-RK3399_EMMC_ADC_PCIE; Case/Package: 0201; Supplier-1: Digikey
R?#9 = RES_1.62K-0.05W-1%-0201: 1.62 kOhms ±1% 0.05W, 1/20W Chip Resistor 0201 (0603 Metric) Automotive AEC-Q200 Thick Film /; Manufacturer: Panasonic Electronic Components; Manufacturer Part Number: ERJ-1GNF1621C; Case/Package: 0201; Supplier-1: Digikey
R?#10 = RES_6.04K-0.05W-1%-0201: 6.04 kOhms ±1% 0.05W, 1/20W Chip Resistor 0201 (0603 Metric) Thick Film /; Manufacturer: Panasonic Electronic Components; Manufacturer Part Number: ERJ-1GEF6041C; Case/Package: 0201; Supplier-1: Digikey
R?#11 = RES_4.02K-0.05W-1%-0201: 4.02 kOhms ±1% 0.05W, 1/20W Chip Resistor 0201 (0603 Metric) Thick Film /; Manufacturer: Yageo; Manufacturer Part Number: RC0201FR-074K02L; Case/Package: 0201; Supplier-1: Digikey
U?#7-U?#9 = IC_RK3399-FCBGA828: as U?#1 on sheet [1]-Power Pins Page of RK3399; Manufacturer Part Number: RK3399; Case/Package: FCBGA828; Supplier-1: Rockchip

## Sheet [4]-USB2, TYPEC, USIC.SchDoc: RK3399 SOM Board Design V1.0
size A4; Author: AVIRAL MISHRA; DocumentNumber: 5; SheetNumber: 5; SheetTotal: 12; PROJECT CODE: A_V1.0
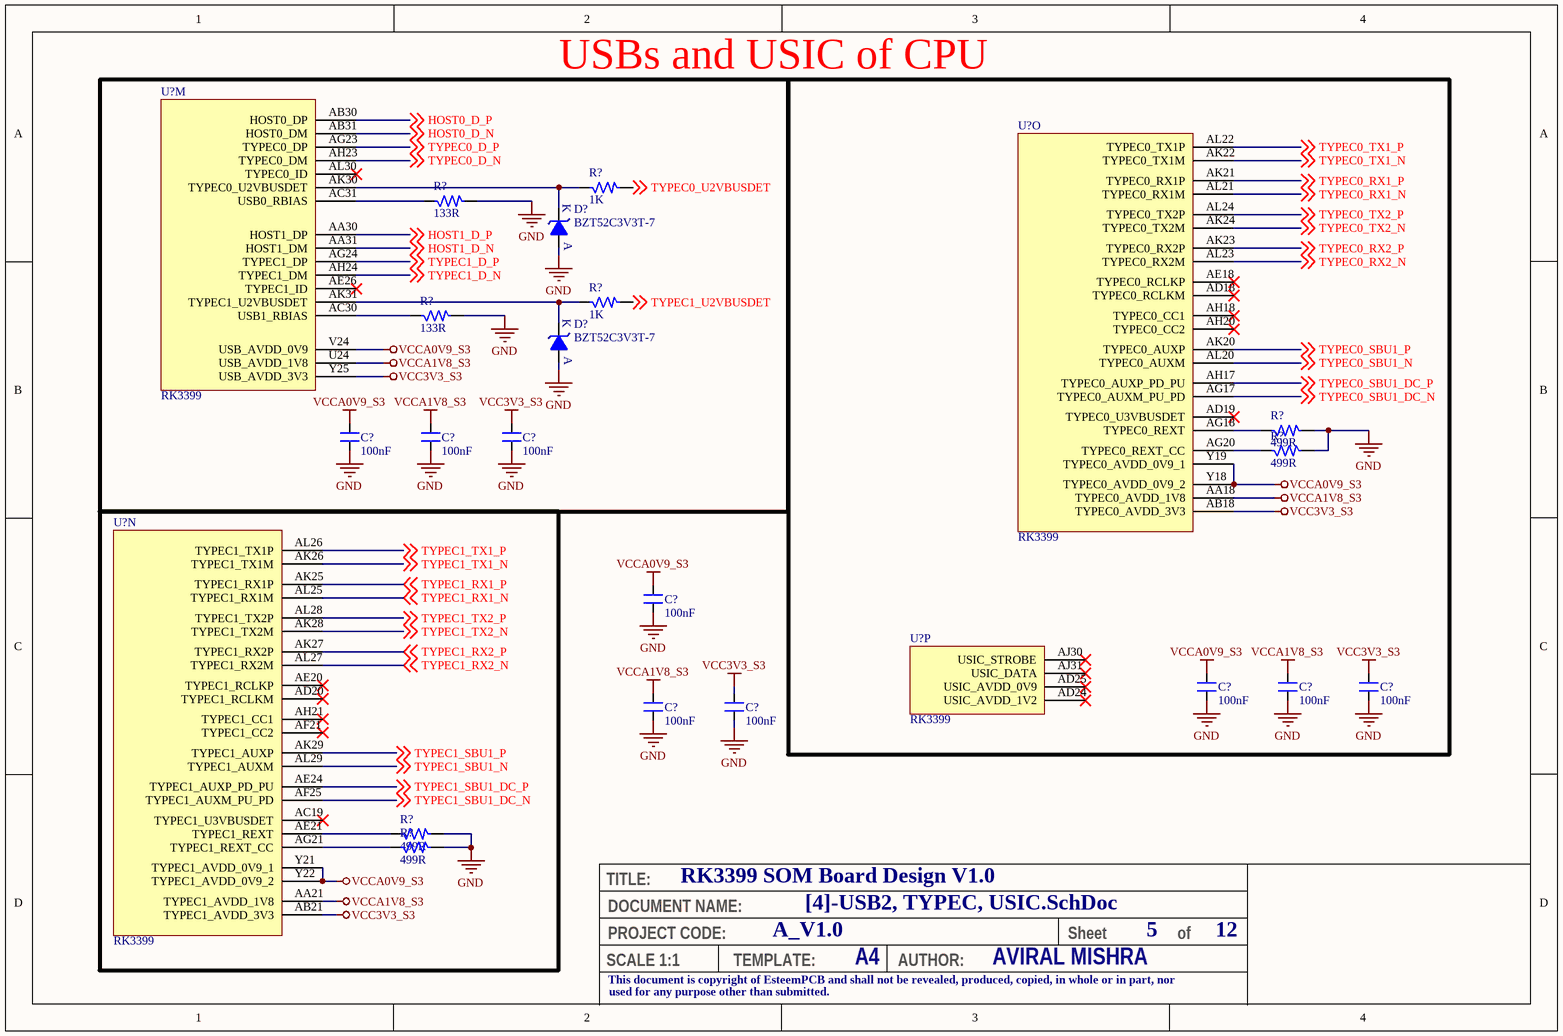
[diagram p4: [4]-USB2, TYPEC, USIC.SchDoc]

### Parts
(Parts that share a designator on the sheet are numbered #1, #2 ... from top to bottom, then left to right.)
C?#80  100nF  [CAP_0201]
C?#81  100nF  [CAP_0201]
C?#82  100nF  [CAP_0201]
C?#83  100nF  [CAP_0201]
C?#84  100nF  [CAP_0201]
C?#85  100nF  [CAP_0201]
C?#86  100nF  [CAP_0201]
C?#87  100nF  [CAP_0201]
C?#88  100nF  [CAP_0201]
D?#2  BZT52C3V3T-7  [DIO_SOD523]
D?#3  BZT52C3V3T-7  [DIO_SOD523]
R?#12  1K  [RES_0201]
R?#13  133R  [RES_0201]
R?#14  1K  [RES_0201]
R?#15  133R  [RES_0201]
R?#16  499R  [RES_0201]
R?#17  499R  [RES_0201]
R?#18  499R  [RES_0201]
R?#19  499R  [RES_0201]
U?#10  RK3399  [FBGA828_23_826X826]  (part M of 24)
U?#11  RK3399  [FBGA828_23_826X826]  (part O of 24)
U?#12  RK3399  [FBGA828_23_826X826]  (part N of 24)
U?#13  RK3399  [FBGA828_23_826X826]  (part P of 24)

### Blocks framed on the sheet
USBs and USIC of CPU: C?#80-C?#82 D?#2 D?#3 R?#12-R?#15 U?#10

### Nets
GND: C?#80.2 C?#81.1 C?#82.1 C?#83.1 C?#84.1 C?#85.1 C?#86.1 C?#87.1 C?#88.1 D?#2.A D?#3.A R?#13.2 R?#15.2 R?#16.2 R?#17.2 R?#18.2 R?#19.2
VCC3V3_S3: C?#82.2 C?#86.2 C?#88.2 U?#10.Y25(USB_AVDD_3V3) U?#11.AB18(TYPEC0_AVDD_3V3) U?#12.AB21(TYPEC1_AVDD_3V3)
VCCA0V9_S3: C?#80.1 C?#83.2 C?#84.2 U?#10.V24(USB_AVDD_0V9) U?#11.Y18(TYPEC0_AVDD_0V9_2) U?#11.Y19(TYPEC0_AVDD_0V9_1) U?#12.Y21(TYPEC1_AVDD_0V9_1) U?#12.Y22(TYPEC1_AVDD_0V9_2)
VCCA1V8_S3: C?#81.2 C?#85.2 C?#87.2 U?#10.U24(USB_AVDD_1V8) U?#11.AA18(TYPEC0_AVDD_1V8) U?#12.AA21(TYPEC1_AVDD_1V8)
HOST0_D_N: U?#10.AB31(HOST0_DM) ; off-sheet HOST0_D_N
HOST0_D_P: U?#10.AB30(HOST0_DP) ; off-sheet HOST0_D_P
HOST1_D_N: U?#10.AA31(HOST1_DM) ; off-sheet HOST1_D_N
HOST1_D_P: U?#10.AA30(HOST1_DP) ; off-sheet HOST1_D_P
TYPEC0_D_N: U?#10.AH23(TYPEC0_DM) ; off-sheet TYPEC0_D_N
TYPEC0_D_P: U?#10.AG23(TYPEC0_DP) ; off-sheet TYPEC0_D_P
TYPEC0_RX1_N: U?#11.AL21(TYPEC0_RX1M) ; off-sheet TYPEC0_RX1_N
TYPEC0_RX1_P: U?#11.AK21(TYPEC0_RX1P) ; off-sheet TYPEC0_RX1_P
TYPEC0_RX2_N: U?#11.AL23(TYPEC0_RX2M) ; off-sheet TYPEC0_RX2_N
TYPEC0_RX2_P: U?#11.AK23(TYPEC0_RX2P) ; off-sheet TYPEC0_RX2_P
TYPEC0_SBU1_DC_N: U?#11.AG17(TYPEC0_AUXM_PU_PD) ; off-sheet TYPEC0_SBU1_DC_N
TYPEC0_SBU1_DC_P: U?#11.AH17(TYPEC0_AUXP_PD_PU) ; off-sheet TYPEC0_SBU1_DC_P
TYPEC0_SBU1_N: U?#11.AL20(TYPEC0_AUXM) ; off-sheet TYPEC0_SBU1_N
TYPEC0_SBU1_P: U?#11.AK20(TYPEC0_AUXP) ; off-sheet TYPEC0_SBU1_P
TYPEC0_TX1_N: U?#11.AK22(TYPEC0_TX1M) ; off-sheet TYPEC0_TX1_N
TYPEC0_TX1_P: U?#11.AL22(TYPEC0_TX1P) ; off-sheet TYPEC0_TX1_P
TYPEC0_TX2_N: U?#11.AK24(TYPEC0_TX2M) ; off-sheet TYPEC0_TX2_N
TYPEC0_TX2_P: U?#11.AL24(TYPEC0_TX2P) ; off-sheet TYPEC0_TX2_P
TYPEC0_U2VBUSDET: R?#12.2 ; off-sheet TYPEC0_U2VBUSDET
TYPEC1_D_N: U?#10.AH24(TYPEC1_DM) ; off-sheet TYPEC1_D_N
TYPEC1_D_P: U?#10.AG24(TYPEC1_DP) ; off-sheet TYPEC1_D_P
TYPEC1_RX1_N: U?#12.AL25(TYPEC1_RX1M) ; off-sheet TYPEC1_RX1_N
TYPEC1_RX1_P: U?#12.AK25(TYPEC1_RX1P) ; off-sheet TYPEC1_RX1_P
TYPEC1_RX2_N: U?#12.AL27(TYPEC1_RX2M) ; off-sheet TYPEC1_RX2_N
TYPEC1_RX2_P: U?#12.AK27(TYPEC1_RX2P) ; off-sheet TYPEC1_RX2_P
TYPEC1_SBU1_DC_N: U?#12.AF25(TYPEC1_AUXM_PU_PD) ; off-sheet TYPEC1_SBU1_DC_N
TYPEC1_SBU1_DC_P: U?#12.AE24(TYPEC1_AUXP_PD_PU) ; off-sheet TYPEC1_SBU1_DC_P
TYPEC1_SBU1_N: U?#12.AL29(TYPEC1_AUXM) ; off-sheet TYPEC1_SBU1_N
TYPEC1_SBU1_P: U?#12.AK29(TYPEC1_AUXP) ; off-sheet TYPEC1_SBU1_P
TYPEC1_TX1_N: U?#12.AK26(TYPEC1_TX1M) ; off-sheet TYPEC1_TX1_N
TYPEC1_TX1_P: U?#12.AL26(TYPEC1_TX1P) ; off-sheet TYPEC1_TX1_P
TYPEC1_TX2_N: U?#12.AK28(TYPEC1_TX2M) ; off-sheet TYPEC1_TX2_N
TYPEC1_TX2_P: U?#12.AL28(TYPEC1_TX2P) ; off-sheet TYPEC1_TX2_P
TYPEC1_U2VBUSDET: R?#14.2 ; off-sheet TYPEC1_U2VBUSDET
NetD?#2_K: D?#2.K R?#12.1 U?#10.AK30(TYPEC0_U2VBUSDET)
NetD?#3_K: D?#3.K R?#14.1 U?#10.AK31(TYPEC1_U2VBUSDET)
NetR?#13_1: R?#13.1 U?#10.AC31(USB0_RBIAS)
NetR?#15_1: R?#15.1 U?#10.AC30(USB1_RBIAS)
NetR?#16_1: R?#16.1 U?#11.AG18(TYPEC0_REXT)
NetR?#17_1: R?#17.1 U?#11.AG20(TYPEC0_REXT_CC)
NetR?#18_1: R?#18.1 U?#12.AE21(TYPEC1_REXT)
NetR?#19_1: R?#19.1 U?#12.AG21(TYPEC1_REXT_CC)

Not connected (* = marked no-connect by the designer): U?#10 AE26(TYPEC1_ID)* AL30(TYPEC0_ID)*; U?#11 AD18(TYPEC0_RCLKM)* AD19(TYPEC0_U3VBUSDET)* AE18(TYPEC0_RCLKP)* AH18(TYPEC0_CC1)* AH20(TYPEC0_CC2)*; U?#12 AC19(TYPEC1_U3VBUSDET)* AD20(TYPEC1_RCLKM)* AE20(TYPEC1_RCLKP)* AF21(TYPEC1_CC2)* AH21(TYPEC1_CC1)*; U?#13 AD24(USIC_AVDD_1V2)* AD25(USIC_AVDD_0V9)* AJ30(USIC_STROBE)* AJ31(USIC_DATA)*

### Notes on the sheet
- TITLE:
- DOCUMENT NAME:
- SCALE 1:1
- This document is copyright of EsteemPCB and shall not be revealed, produced, copied, in whole or in part, nor
- PROJECT CODE:
- TEMPLATE:
- A4
- AUTHOR:
- Sheet
- of
- used for any purpose other than submitted.

### Library data of the parts
C?#80-C?#88 = CAP_100nF-25V-10%-0201: as C?#9 on sheet [1]-Power Pins Page of RK3399; Case/Package: 0201; Supplier-1: Digikey
D?#2 D?#3 = DIO-Z_3.3V-300mW-SOD-523: as D?#1 on sheet [3]-RK3399 EDP_CSI_HDMI; Manufacturer Part Number: BZT52C3V3T-7; Case/Package: SOD523; Supplier-1: Digikey
R?#12 R?#14 = RES_1K-0.05W-1%-0201: 1 kOhms ±1% 0.05W, 1/20W Chip Resistor 0201 (0603 Metric) Thick Film /; Manufacturer: Yageo; Manufacturer Part Number: RC0201FR-071KL; Case/Package: 0201; Supplier-1: Digikey
R?#13 R?#15 = RES_133R-0.05W-1%-0201: 133 Ohms ±1% 0.05W, 1/20W Chip Resistor 0201 (0603 Metric) Automotive AEC-Q200 Thick Film /; Manufacturer: Panasonic Electronic Components; Manufacturer Part Number: ERJ-1GNF1330C; Case/Package: 0201; Supplier-1: Digikey
R?#16-R?#19 = RES_499R-0.05W-1%-0201: 499 Ohms ±1% 0.05W, 1/20W Chip Resistor 0201 (0603 Metric) Thick Film /; Manufacturer: Stackpole Electronics Inc; Manufacturer Part Number: RMCF0201FT499R; Case/Package: 0201; Supplier-1: Digikey
U?#10-U?#13 = IC_RK3399-FCBGA828: as U?#1 on sheet [1]-Power Pins Page of RK3399; Manufacturer Part Number: RK3399; Case/Package: FCBGA828; Supplier-1: Rockchip

## Sheet [5]-MIPI-CSI_GPIOs and I2C.SchDoc: RK3399 SOM Board Design V1.0
size A4; Author: AVIRAL MISHRA; DocumentNumber: 6; SheetNumber: 6; SheetTotal: 12; PROJECT CODE: A_V1.0
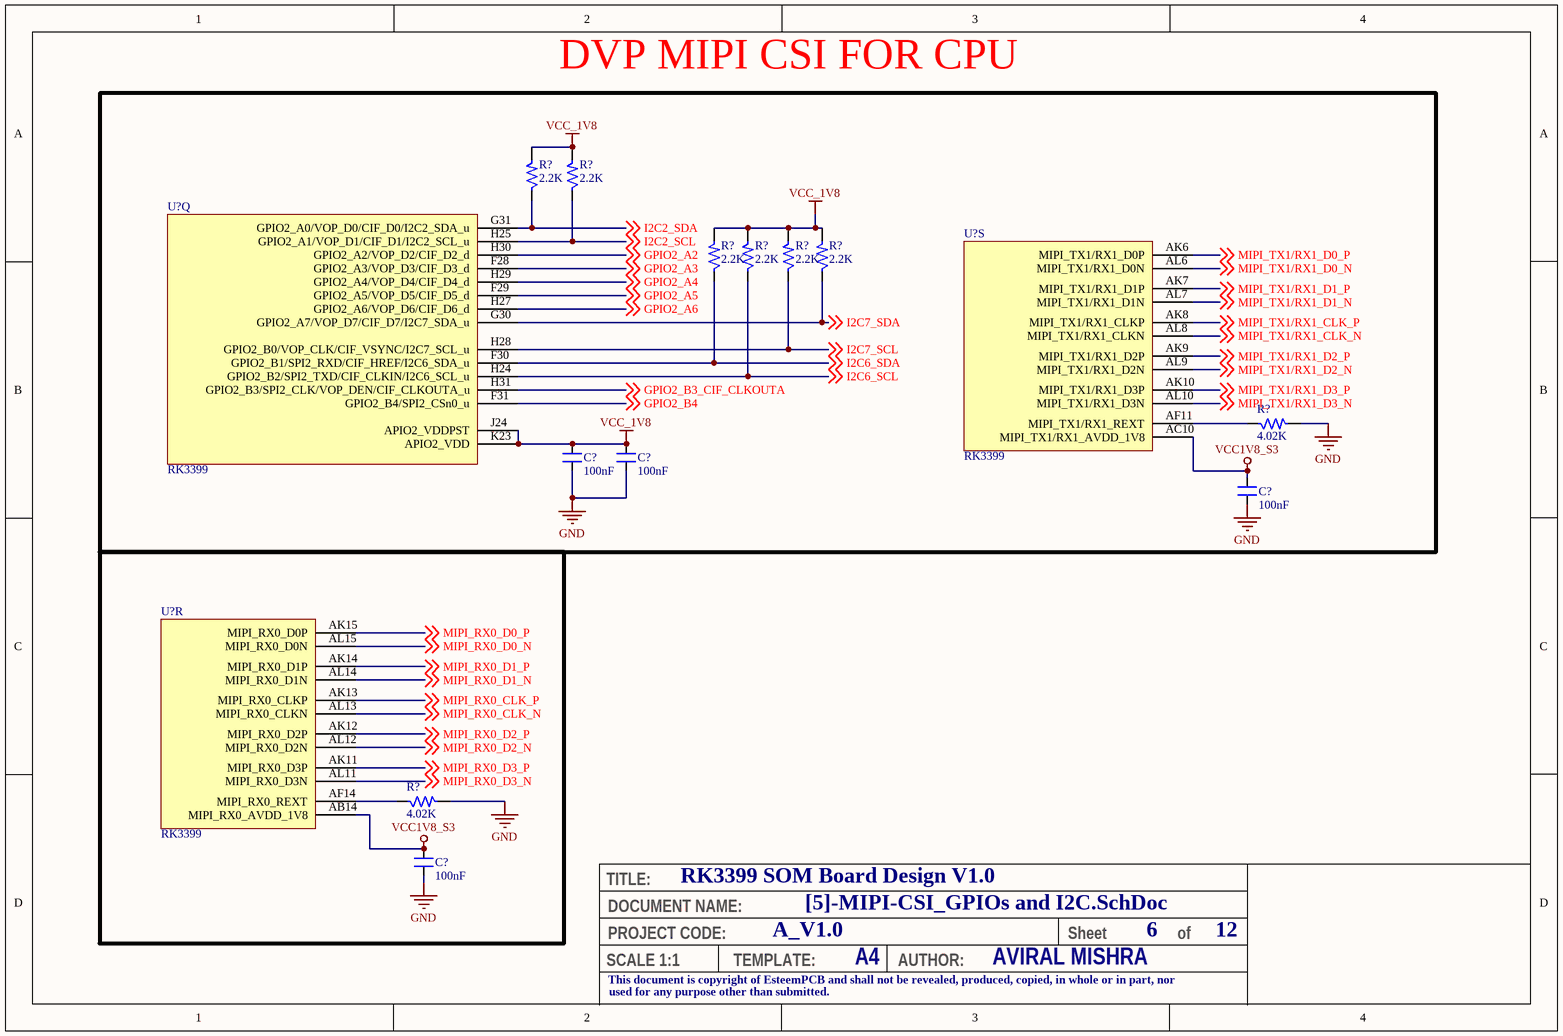
[diagram p5: [5]-MIPI-CSI_GPIOs and I2C.SchDoc]

### Parts
(Parts that share a designator on the sheet are numbered #1, #2 ... from top to bottom, then left to right.)
C?#89  100nF  [CAP_0201]
C?#90  100nF  [CAP_0201]
C?#91  100nF  [CAP_0201]
C?#92  100nF  [CAP_0201]
R?#20  2.2K  [RES_0201]
R?#21  2.2K  [RES_0201]
R?#22  2.2K  [RES_0201]
R?#23  2.2K  [RES_0201]
R?#24  2.2K  [RES_0201]
R?#25  2.2K  [RES_0201]
R?#26  4.02K  [RES_0201]
R?#27  4.02K  [RES_0201]
U?#14  RK3399  [FBGA828_23_826X826]  (part Q of 24)
U?#15  RK3399  [FBGA828_23_826X826]  (part S of 24)
U?#16  RK3399  [FBGA828_23_826X826]  (part R of 24)

### Blocks framed on the sheet
DVP MIPI CSI FOR CPU: C?#89-C?#91 R?#20-R?#26 U?#14 U?#15

### Nets
GND: C?#89.1 C?#90.1 C?#91.1 C?#92.1 R?#26.2 R?#27.2
VCC1V8_S3: C?#91.2 C?#92.2 U?#15.AC10(MIPI_TX1/RX1_AVDD_1V8) U?#16.AB14(MIPI_RX0_AVDD_1V8)
VCC_1V8: C?#89.2 C?#90.2 R?#20.2 R?#21.2 R?#22.2 R?#23.2 R?#24.2 R?#25.2 U?#14.J24(APIO2_VDDPST) U?#14.K23(APIO2_VDD)
GPIO2_A2: U?#14.H30(GPIO2_A2/VOP_D2/CIF_D2_d) ; off-sheet GPIO2_A2
GPIO2_A3: U?#14.F28(GPIO2_A3/VOP_D3/CIF_D3_d) ; off-sheet GPIO2_A3
GPIO2_A4: U?#14.H29(GPIO2_A4/VOP_D4/CIF_D4_d) ; off-sheet GPIO2_A4
GPIO2_A5: U?#14.F29(GPIO2_A5/VOP_D5/CIF_D5_d) ; off-sheet GPIO2_A5
GPIO2_A6: U?#14.H27(GPIO2_A6/VOP_D6/CIF_D6_d) ; off-sheet GPIO2_A6
GPIO2_B3_CIF_CLKOUTA: U?#14.H31(GPIO2_B3/SPI2_CLK/VOP_DEN/CIF_CLKOUTA_u) ; off-sheet GPIO2_B3_CIF_CLKOUTA
GPIO2_B4: U?#14.F31(GPIO2_B4/SPI2_CSn0_u) ; off-sheet GPIO2_B4
I2C2_SCL: R?#21.1 U?#14.H25(GPIO2_A1/VOP_D1/CIF_D1/I2C2_SCL_u) ; off-sheet I2C2_SCL
I2C2_SDA: R?#20.1 U?#14.G31(GPIO2_A0/VOP_D0/CIF_D0/I2C2_SDA_u) ; off-sheet I2C2_SDA
I2C6_SCL: R?#23.1 U?#14.H24(GPIO2_B2/SPI2_TXD/CIF_CLKIN/I2C6_SCL_u) ; off-sheet I2C6_SCL
I2C6_SDA: R?#22.1 U?#14.F30(GPIO2_B1/SPI2_RXD/CIF_HREF/I2C6_SDA_u) ; off-sheet I2C6_SDA
I2C7_SCL: R?#24.1 U?#14.H28(GPIO2_B0/VOP_CLK/CIF_VSYNC/I2C7_SCL_u) ; off-sheet I2C7_SCL
I2C7_SDA: R?#25.1 U?#14.G30(GPIO2_A7/VOP_D7/CIF_D7/I2C7_SDA_u) ; off-sheet I2C7_SDA
MIPI_RX0_CLK_N: U?#16.AL13(MIPI_RX0_CLKN) ; off-sheet MIPI_RX0_CLK_N
MIPI_RX0_CLK_P: U?#16.AK13(MIPI_RX0_CLKP) ; off-sheet MIPI_RX0_CLK_P
MIPI_RX0_D0_N: U?#16.AL15(MIPI_RX0_D0N) ; off-sheet MIPI_RX0_D0_N
MIPI_RX0_D0_P: U?#16.AK15(MIPI_RX0_D0P) ; off-sheet MIPI_RX0_D0_P
MIPI_RX0_D1_N: U?#16.AL14(MIPI_RX0_D1N) ; off-sheet MIPI_RX0_D1_N
MIPI_RX0_D1_P: U?#16.AK14(MIPI_RX0_D1P) ; off-sheet MIPI_RX0_D1_P
MIPI_RX0_D2_N: U?#16.AL12(MIPI_RX0_D2N) ; off-sheet MIPI_RX0_D2_N
MIPI_RX0_D2_P: U?#16.AK12(MIPI_RX0_D2P) ; off-sheet MIPI_RX0_D2_P
MIPI_RX0_D3_N: U?#16.AL11(MIPI_RX0_D3N) ; off-sheet MIPI_RX0_D3_N
MIPI_RX0_D3_P: U?#16.AK11(MIPI_RX0_D3P) ; off-sheet MIPI_RX0_D3_P
MIPI_TX1/RX1_CLK_N: U?#15.AL8(MIPI_TX1/RX1_CLKN) ; off-sheet MIPI_TX1/RX1_CLK_N
MIPI_TX1/RX1_CLK_P: U?#15.AK8(MIPI_TX1/RX1_CLKP) ; off-sheet MIPI_TX1/RX1_CLK_P
MIPI_TX1/RX1_D0_N: U?#15.AL6(MIPI_TX1/RX1_D0N) ; off-sheet MIPI_TX1/RX1_D0_N
MIPI_TX1/RX1_D0_P: U?#15.AK6(MIPI_TX1/RX1_D0P) ; off-sheet MIPI_TX1/RX1_D0_P
MIPI_TX1/RX1_D1_N: U?#15.AL7(MIPI_TX1/RX1_D1N) ; off-sheet MIPI_TX1/RX1_D1_N
MIPI_TX1/RX1_D1_P: U?#15.AK7(MIPI_TX1/RX1_D1P) ; off-sheet MIPI_TX1/RX1_D1_P
MIPI_TX1/RX1_D2_N: U?#15.AL9(MIPI_TX1/RX1_D2N) ; off-sheet MIPI_TX1/RX1_D2_N
MIPI_TX1/RX1_D2_P: U?#15.AK9(MIPI_TX1/RX1_D2P) ; off-sheet MIPI_TX1/RX1_D2_P
MIPI_TX1/RX1_D3_N: U?#15.AL10(MIPI_TX1/RX1_D3N) ; off-sheet MIPI_TX1/RX1_D3_N
MIPI_TX1/RX1_D3_P: U?#15.AK10(MIPI_TX1/RX1_D3P) ; off-sheet MIPI_TX1/RX1_D3_P
NetR?#26_1: R?#26.1 U?#15.AF11(MIPI_TX1/RX1_REXT)
NetR?#27_1: R?#27.1 U?#16.AF14(MIPI_RX0_REXT)

### Notes on the sheet
- TITLE:
- DOCUMENT NAME:
- SCALE 1:1
- This document is copyright of EsteemPCB and shall not be revealed, produced, copied, in whole or in part, nor
- PROJECT CODE:
- TEMPLATE:
- A4
- AUTHOR:
- Sheet
- of
- used for any purpose other than submitted.

### Library data of the parts
C?#89-C?#92 = CAP_100nF-25V-10%-0201: as C?#9 on sheet [1]-Power Pins Page of RK3399; Case/Package: 0201; Supplier-1: Digikey
R?#20-R?#25 = RES_2.2K-0.05W-1%-0201: 2.2 kOhms ±1% 0.05W, 1/20W Chip Resistor 0201 (0603 Metric) Thick Film /; Manufacturer: Stackpole Electronics Inc; Manufacturer Part Number: RMCF0201FT2K20; Case/Package: 0201; Supplier-1: Digikey
R?#26 R?#27 = RES_4.02K-0.05W-1%-0201: as R?#11 on sheet [3]-RK3399 EDP_CSI_HDMI; Case/Package: 0201; Supplier-1: Digikey
U?#14-U?#16 = IC_RK3399-FCBGA828: as U?#1 on sheet [1]-Power Pins Page of RK3399; Manufacturer Part Number: RK3399; Case/Package: FCBGA828; Supplier-1: Rockchip

## Sheet [6]-RGMII_SDIO_SPI_GPIOs etc.SchDoc: RK3399 SOM Board Design V1.0
size A3; Author: ABC; Organization: Altium Limited; Address1: L3, 12a Rodborough Rd; Address2: Frenchs Forest; Address3: NSW; Address4: Australia 2086; DocumentNumber: 7; SheetNumber: 7; SheetTotal: 12; PROJECT CODE: A_V1.0
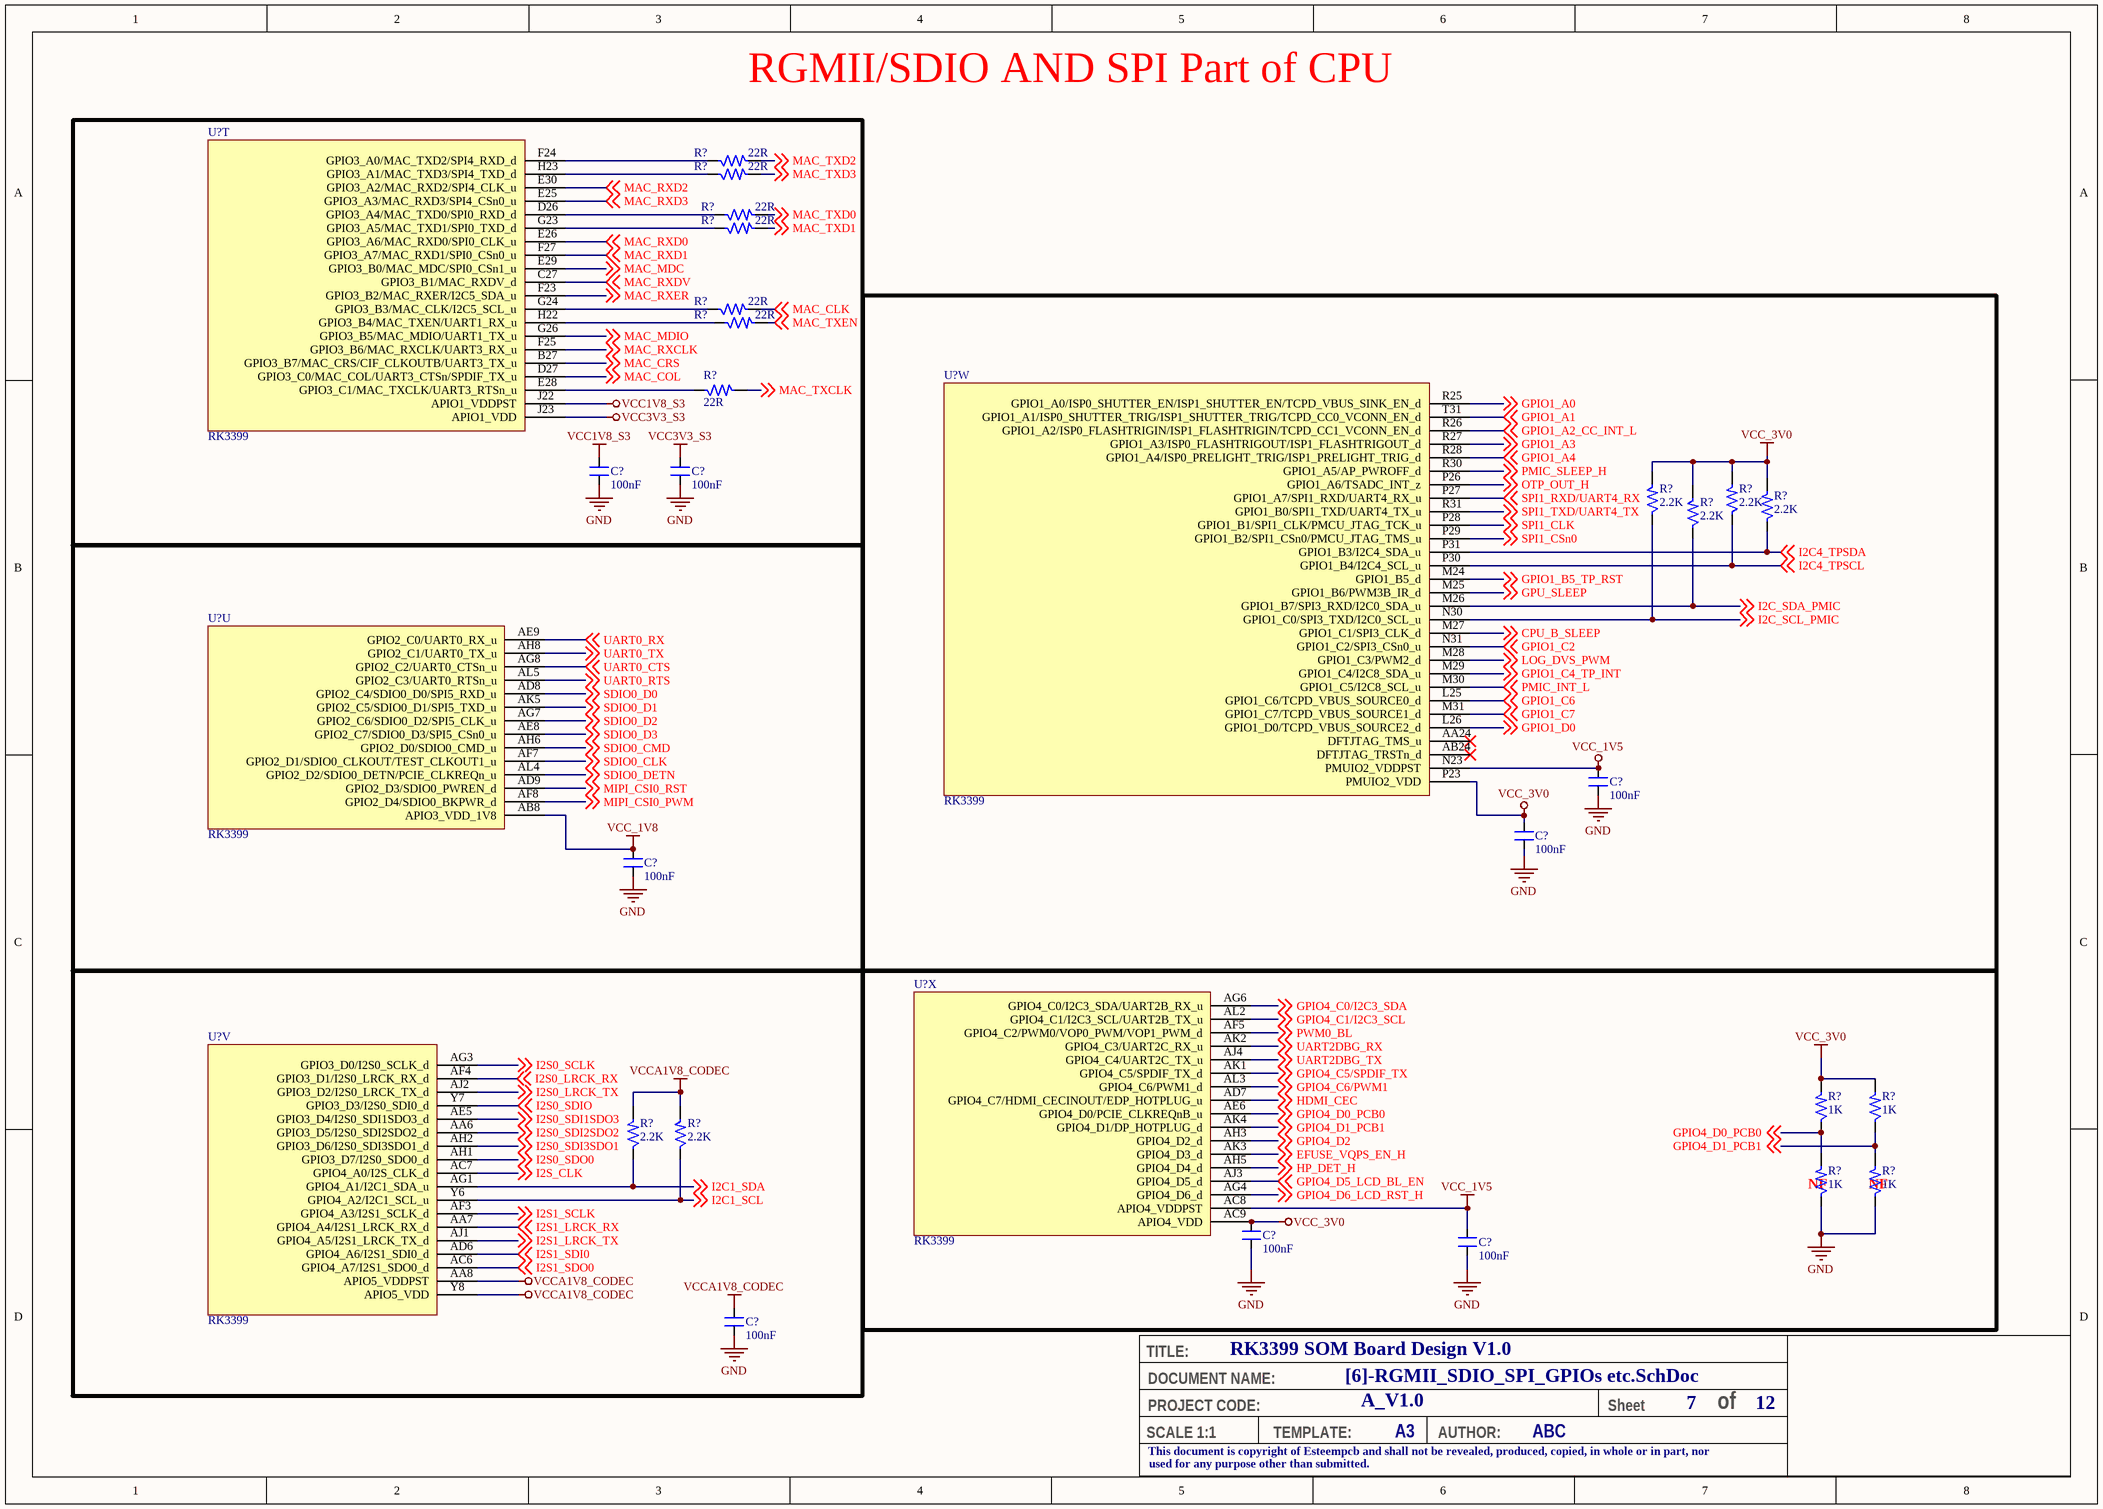
[diagram p6: [6]-RGMII_SDIO_SPI_GPIOs etc.SchDoc]

### Parts
(Parts that share a designator on the sheet are numbered #1, #2 ... from top to bottom, then left to right.)
C?#93  100nF  [CAP_0201]
C?#94  100nF  [CAP_0201]
C?#95  100nF  [CAP_0201]
C?#96  100nF  [CAP_0201]
C?#97  100nF  [CAP_0201]
C?#98  100nF  [CAP_0201]
C?#99  100nF  [CAP_0201]
C?#100  100nF  [CAP_0201]
R?#28  22R  [RES_0201]
R?#29  22R  [RES_0201]
R?#30  22R  [RES_0201]
R?#31  22R  [RES_0201]
R?#32  22R  [RES_0201]
R?#33  22R  [RES_0201]
R?#34  22R  [RES_0201]
R?#35  2.2K  [RES_0201]
R?#36  2.2K  [RES_0201]
R?#37  2.2K  [RES_0201]
R?#38  2.2K  [RES_0201]
R?#39  1K  [RES_0201]
R?#40  1K  [RES_0201]
R?#41  2.2K  [RES_0201]
R?#42  2.2K  [RES_0201]
R?#43  1K  [RES_0201]
R?#44  1K  [RES_0201]
U?#17  RK3399  [FBGA828_23_826X826]  (part T of 24)
U?#18  RK3399  [FBGA828_23_826X826]  (part W of 24)
U?#19  RK3399  [FBGA828_23_826X826]  (part U of 24)
U?#20  RK3399  [FBGA828_23_826X826]  (part X of 24)
U?#21  RK3399  [FBGA828_23_826X826]  (part V of 24)

### Nets
GND: C?#93.1 C?#94.1 C?#95.1 C?#96.1 C?#97.1 C?#98.1 C?#99.1 C?#100.1 R?#43.1 R?#44.1
VCC1V8_S3: C?#93.2 U?#17.J22(APIO1_VDDPST)
VCC3V3_S3: C?#94.2 U?#17.J23(APIO1_VDD)
VCC_1V5: C?#95.2 C?#99.2 U?#18.N23(PMUIO2_VDDPST) U?#20.AC8(APIO4_VDDPST)
VCC_1V8: C?#97.2 U?#19.AB8(APIO3_VDD_1V8)
VCC_3V0: C?#96.2 C?#98.2 R?#35.2 R?#36.2 R?#37.2 R?#38.2 R?#39.2 R?#40.2 U?#18.P23(PMUIO2_VDD) U?#20.AC9(APIO4_VDD)
VCCA1V8_CODEC: C?#100.2 R?#41.2 R?#42.2 U?#21.AA8(APIO5_VDDPST) U?#21.Y8(APIO5_VDD)
CPU_B_SLEEP: U?#18.M27(GPIO1_C1/SPI3_CLK_d) ; off-sheet CPU_B_SLEEP
EFUSE_VQPS_EN_H: U?#20.AK3(GPIO4_D3_d) ; off-sheet EFUSE_VQPS_EN_H
GPIO1_A0: U?#18.R25(GPIO1_A0/ISP0_SHUTTER_EN/ISP1_SHUTTER_EN/TCPD_VBUS_SINK_EN_d) ; off-sheet GPIO1_A0
GPIO1_A1: U?#18.T31(GPIO1_A1/ISP0_SHUTTER_TRIG/ISP1_SHUTTER_TRIG/TCPD_CC0_VCONN_EN_d) ; off-sheet GPIO1_A1
GPIO1_A2_CC_INT_L: U?#18.R26(GPIO1_A2/ISP0_FLASHTRIGIN/ISP1_FLASHTRIGIN/TCPD_CC1_VCONN_EN_d) ; off-sheet GPIO1_A2_CC_INT_L
GPIO1_A3: U?#18.R27(GPIO1_A3/ISP0_FLASHTRIGOUT/ISP1_FLASHTRIGOUT_d) ; off-sheet GPIO1_A3
GPIO1_A4: U?#18.R28(GPIO1_A4/ISP0_PRELIGHT_TRIG/ISP1_PRELIGHT_TRIG_d) ; off-sheet GPIO1_A4
GPIO1_B5_TP_RST: U?#18.M24(GPIO1_B5_d) ; off-sheet GPIO1_B5_TP_RST
GPIO1_C2: U?#18.N31(GPIO1_C2/SPI3_CSn0_u) ; off-sheet GPIO1_C2
GPIO1_C4_TP_INT: U?#18.M29(GPIO1_C4/I2C8_SDA_u) ; off-sheet GPIO1_C4_TP_INT
GPIO1_C6: U?#18.L25(GPIO1_C6/TCPD_VBUS_SOURCE0_d) ; off-sheet GPIO1_C6
GPIO1_C7: U?#18.M31(GPIO1_C7/TCPD_VBUS_SOURCE1_d) ; off-sheet GPIO1_C7
GPIO1_D0: U?#18.L26(GPIO1_D0/TCPD_VBUS_SOURCE2_d) ; off-sheet GPIO1_D0
GPIO4_C0/I2C3_SDA: U?#20.AG6(GPIO4_C0/I2C3_SDA/UART2B_RX_u) ; off-sheet GPIO4_C0/I2C3_SDA
GPIO4_C1/I2C3_SCL: U?#20.AL2(GPIO4_C1/I2C3_SCL/UART2B_TX_u) ; off-sheet GPIO4_C1/I2C3_SCL
GPIO4_C5/SPDIF_TX: U?#20.AK1(GPIO4_C5/SPDIF_TX_d) ; off-sheet GPIO4_C5/SPDIF_TX
GPIO4_C6/PWM1: U?#20.AL3(GPIO4_C6/PWM1_d) ; off-sheet GPIO4_C6/PWM1
GPIO4_D0_PCB0: R?#39.1 R?#43.2 U?#20.AE6(GPIO4_D0/PCIE_CLKREQnB_u) ; off-sheet GPIO4_D0_PCB0
GPIO4_D1_PCB1: R?#40.1 R?#44.2 U?#20.AK4(GPIO4_D1/DP_HOTPLUG_d) ; off-sheet GPIO4_D1_PCB1
GPIO4_D2: U?#20.AH3(GPIO4_D2_d) ; off-sheet GPIO4_D2
GPIO4_D5_LCD_BL_EN: U?#20.AJ3(GPIO4_D5_d) ; off-sheet GPIO4_D5_LCD_BL_EN
GPIO4_D6_LCD_RST_H: U?#20.AG4(GPIO4_D6_d) ; off-sheet GPIO4_D6_LCD_RST_H
GPU_SLEEP: U?#18.M25(GPIO1_B6/PWM3B_IR_d) ; off-sheet GPU_SLEEP
HDMI_CEC: U?#20.AD7(GPIO4_C7/HDMI_CECINOUT/EDP_HOTPLUG_u) ; off-sheet HDMI_CEC
HP_DET_H: U?#20.AH5(GPIO4_D4_d) ; off-sheet HP_DET_H
I2C1_SCL: R?#42.1 U?#21.Y6(GPIO4_A2/I2C1_SCL_u) ; off-sheet I2C1_SCL
I2C1_SDA: R?#41.1 U?#21.AG1(GPIO4_A1/I2C1_SDA_u) ; off-sheet I2C1_SDA
I2C4_TPSCL: R?#36.1 U?#18.P30(GPIO1_B4/I2C4_SCL_u) ; off-sheet I2C4_TPSCL
I2C4_TPSDA: R?#37.1 U?#18.P31(GPIO1_B3/I2C4_SDA_u) ; off-sheet I2C4_TPSDA
I2C_SCL_PMIC: R?#35.1 U?#18.N30(GPIO1_C0/SPI3_TXD/I2C0_SCL_u) ; off-sheet I2C_SCL_PMIC
I2C_SDA_PMIC: R?#38.1 U?#18.M26(GPIO1_B7/SPI3_RXD/I2C0_SDA_u) ; off-sheet I2C_SDA_PMIC
I2S0_LRCK_RX: U?#21.AF4(GPIO3_D1/I2S0_LRCK_RX_d) ; off-sheet I2S0_LRCK_RX
I2S0_LRCK_TX: U?#21.AJ2(GPIO3_D2/I2S0_LRCK_TX_d) ; off-sheet I2S0_LRCK_TX
I2S0_SCLK: U?#21.AG3(GPIO3_D0/I2S0_SCLK_d) ; off-sheet I2S0_SCLK
I2S0_SDI1SDO3: U?#21.AE5(GPIO3_D4/I2S0_SDI1SDO3_d) ; off-sheet I2S0_SDI1SDO3
I2S0_SDI2SDO2: U?#21.AA6(GPIO3_D5/I2S0_SDI2SDO2_d) ; off-sheet I2S0_SDI2SDO2
I2S0_SDI3SDO1: U?#21.AH2(GPIO3_D6/I2S0_SDI3SDO1_d) ; off-sheet I2S0_SDI3SDO1
I2S0_SDIO: U?#21.Y7(GPIO3_D3/I2S0_SDI0_d) ; off-sheet I2S0_SDIO
I2S0_SDO0: U?#21.AH1(GPIO3_D7/I2S0_SDO0_d) ; off-sheet I2S0_SDO0
I2S1_LRCK_RX: U?#21.AA7(GPIO4_A4/I2S1_LRCK_RX_d) ; off-sheet I2S1_LRCK_RX
I2S1_LRCK_TX: U?#21.AJ1(GPIO4_A5/I2S1_LRCK_TX_d) ; off-sheet I2S1_LRCK_TX
I2S1_SCLK: U?#21.AF3(GPIO4_A3/I2S1_SCLK_d) ; off-sheet I2S1_SCLK
I2S1_SDI0: U?#21.AD6(GPIO4_A6/I2S1_SDI0_d) ; off-sheet I2S1_SDI0
I2S1_SDO0: U?#21.AC6(GPIO4_A7/I2S1_SDO0_d) ; off-sheet I2S1_SDO0
I2S_CLK: U?#21.AC7(GPIO4_A0/I2S_CLK_d) ; off-sheet I2S_CLK
LOG_DVS_PWM: U?#18.M28(GPIO1_C3/PWM2_d) ; off-sheet LOG_DVS_PWM
MAC_CLK: R?#32.2 ; off-sheet MAC_CLK
MAC_COL: U?#17.D27(GPIO3_C0/MAC_COL/UART3_CTSn/SPDIF_TX_u) ; off-sheet MAC_COL
MAC_CRS: U?#17.B27(GPIO3_B7/MAC_CRS/CIF_CLKOUTB/UART3_TX_u) ; off-sheet MAC_CRS
MAC_MDC: U?#17.E29(GPIO3_B0/MAC_MDC/SPI0_CSn1_u) ; off-sheet MAC_MDC
MAC_MDIO: U?#17.G26(GPIO3_B5/MAC_MDIO/UART1_TX_u) ; off-sheet MAC_MDIO
MAC_RXCLK: U?#17.F25(GPIO3_B6/MAC_RXCLK/UART3_RX_u) ; off-sheet MAC_RXCLK
MAC_RXD0: U?#17.E26(GPIO3_A6/MAC_RXD0/SPI0_CLK_u) ; off-sheet MAC_RXD0
MAC_RXD1: U?#17.F27(GPIO3_A7/MAC_RXD1/SPI0_CSn0_u) ; off-sheet MAC_RXD1
MAC_RXD2: U?#17.E30(GPIO3_A2/MAC_RXD2/SPI4_CLK_u) ; off-sheet MAC_RXD2
MAC_RXD3: U?#17.E25(GPIO3_A3/MAC_RXD3/SPI4_CSn0_u) ; off-sheet MAC_RXD3
MAC_RXDV: U?#17.C27(GPIO3_B1/MAC_RXDV_d) ; off-sheet MAC_RXDV
MAC_RXER: U?#17.F23(GPIO3_B2/MAC_RXER/I2C5_SDA_u) ; off-sheet MAC_RXER
MAC_TXCLK: R?#34.2 ; off-sheet MAC_TXCLK
MAC_TXD0: R?#30.2 ; off-sheet MAC_TXD0
MAC_TXD1: R?#31.2 ; off-sheet MAC_TXD1
MAC_TXD2: R?#28.2 ; off-sheet MAC_TXD2
MAC_TXD3: R?#29.2 ; off-sheet MAC_TXD3
MAC_TXEN: R?#33.2 ; off-sheet MAC_TXEN
MIPI_CSI0_PWM: U?#19.AF8(GPIO2_D4/SDIO0_BKPWR_d) ; off-sheet MIPI_CSI0_PWM
MIPI_CSI0_RST: U?#19.AD9(GPIO2_D3/SDIO0_PWREN_d) ; off-sheet MIPI_CSI0_RST
OTP_OUT_H: U?#18.P26(GPIO1_A6/TSADC_INT_z) ; off-sheet OTP_OUT_H
PMIC_INT_L: U?#18.M30(GPIO1_C5/I2C8_SCL_u) ; off-sheet PMIC_INT_L
PMIC_SLEEP_H: U?#18.R30(GPIO1_A5/AP_PWROFF_d) ; off-sheet PMIC_SLEEP_H
PWM0_BL: U?#20.AF5(GPIO4_C2/PWM0/VOP0_PWM/VOP1_PWM_d) ; off-sheet PWM0_BL
SDIO0_CLK: U?#19.AF7(GPIO2_D1/SDIO0_CLKOUT/TEST_CLKOUT1_u) ; off-sheet SDIO0_CLK
SDIO0_CMD: U?#19.AH6(GPIO2_D0/SDIO0_CMD_u) ; off-sheet SDIO0_CMD
SDIO0_D0: U?#19.AD8(GPIO2_C4/SDIO0_D0/SPI5_RXD_u) ; off-sheet SDIO0_D0
SDIO0_D1: U?#19.AK5(GPIO2_C5/SDIO0_D1/SPI5_TXD_u) ; off-sheet SDIO0_D1
SDIO0_D2: U?#19.AG7(GPIO2_C6/SDIO0_D2/SPI5_CLK_u) ; off-sheet SDIO0_D2
SDIO0_D3: U?#19.AE8(GPIO2_C7/SDIO0_D3/SPI5_CSn0_u) ; off-sheet SDIO0_D3
SDIO0_DETN: U?#19.AL4(GPIO2_D2/SDIO0_DETN/PCIE_CLKREQn_u) ; off-sheet SDIO0_DETN
SPI1_CLK: U?#18.P28(GPIO1_B1/SPI1_CLK/PMCU_JTAG_TCK_u) ; off-sheet SPI1_CLK
SPI1_CSn0: U?#18.P29(GPIO1_B2/SPI1_CSn0/PMCU_JTAG_TMS_u) ; off-sheet SPI1_CSn0
SPI1_RXD/UART4_RX: U?#18.P27(GPIO1_A7/SPI1_RXD/UART4_RX_u) ; off-sheet SPI1_RXD/UART4_RX
SPI1_TXD/UART4_TX: U?#18.R31(GPIO1_B0/SPI1_TXD/UART4_TX_u) ; off-sheet SPI1_TXD/UART4_TX
UART0_CTS: U?#19.AG8(GPIO2_C2/UART0_CTSn_u) ; off-sheet UART0_CTS
UART0_RTS: U?#19.AL5(GPIO2_C3/UART0_RTSn_u) ; off-sheet UART0_RTS
UART0_RX: U?#19.AE9(GPIO2_C0/UART0_RX_u) ; off-sheet UART0_RX
UART0_TX: U?#19.AH8(GPIO2_C1/UART0_TX_u) ; off-sheet UART0_TX
UART2DBG_RX: U?#20.AK2(GPIO4_C3/UART2C_RX_u) ; off-sheet UART2DBG_RX
UART2DBG_TX: U?#20.AJ4(GPIO4_C4/UART2C_TX_u) ; off-sheet UART2DBG_TX
NetR?#28_1: R?#28.1 U?#17.F24(GPIO3_A0/MAC_TXD2/SPI4_RXD_d)
NetR?#29_1: R?#29.1 U?#17.H23(GPIO3_A1/MAC_TXD3/SPI4_TXD_d)
NetR?#30_1: R?#30.1 U?#17.D26(GPIO3_A4/MAC_TXD0/SPI0_RXD_d)
NetR?#31_1: R?#31.1 U?#17.G23(GPIO3_A5/MAC_TXD1/SPI0_TXD_d)
NetR?#32_1: R?#32.1 U?#17.G24(GPIO3_B3/MAC_CLK/I2C5_SCL_u)
NetR?#33_1: R?#33.1 U?#17.H22(GPIO3_B4/MAC_TXEN/UART1_RX_u)
NetR?#34_1: R?#34.1 U?#17.E28(GPIO3_C1/MAC_TXCLK/UART3_RTSn_u)

Not connected (* = marked no-connect by the designer): U?#18 AA24(DFTJTAG_TMS_u)* AB24(DFTJTAG_TRSTn_d)*

### Notes on the sheet
- RGMII/SDIO AND SPI Part of CPU
- (near R?#43) NF
- (near R?#44) NF
- TITLE:
- DOCUMENT NAME:
- SCALE 1:1
- This document is copyright of Esteempcb and shall not be revealed, produced, copied, in whole or in part, nor
- PROJECT CODE:
- TEMPLATE:
- A3
- AUTHOR:
- Sheet
- of
- used for any purpose other than submitted.

### Library data of the parts
C?#93-C?#100 = CAP_100nF-25V-10%-0201: as C?#9 on sheet [1]-Power Pins Page of RK3399; Case/Package: 0201; Supplier-1: Digikey
R?#28-R?#34 = RES_22R-0.05W-1%-0201: as R?#1 on sheet [2]-RK3399_EMMC_ADC_PCIE; Case/Package: 0201; Supplier-1: Digikey
R?#35-R?#38 R?#41 R?#42 = RES_2.2K-0.05W-1%-0201: as R?#20 on sheet [5]-MIPI-CSI_GPIOs and I2C; Case/Package: 0201; Supplier-1: Digikey
R?#39 R?#40 R?#43 R?#44 = RES_1K-0.05W-1%-0201: as R?#12 on sheet [4]-USB2, TYPEC, USIC; Case/Package: 0201; Supplier-1: Digikey
U?#17-U?#21 = IC_RK3399-FCBGA828: as U?#1 on sheet [1]-Power Pins Page of RK3399; Manufacturer Part Number: RK3399; Case/Package: FCBGA828; Supplier-1: Rockchip